# Altium project vision-pi.PrjPcb
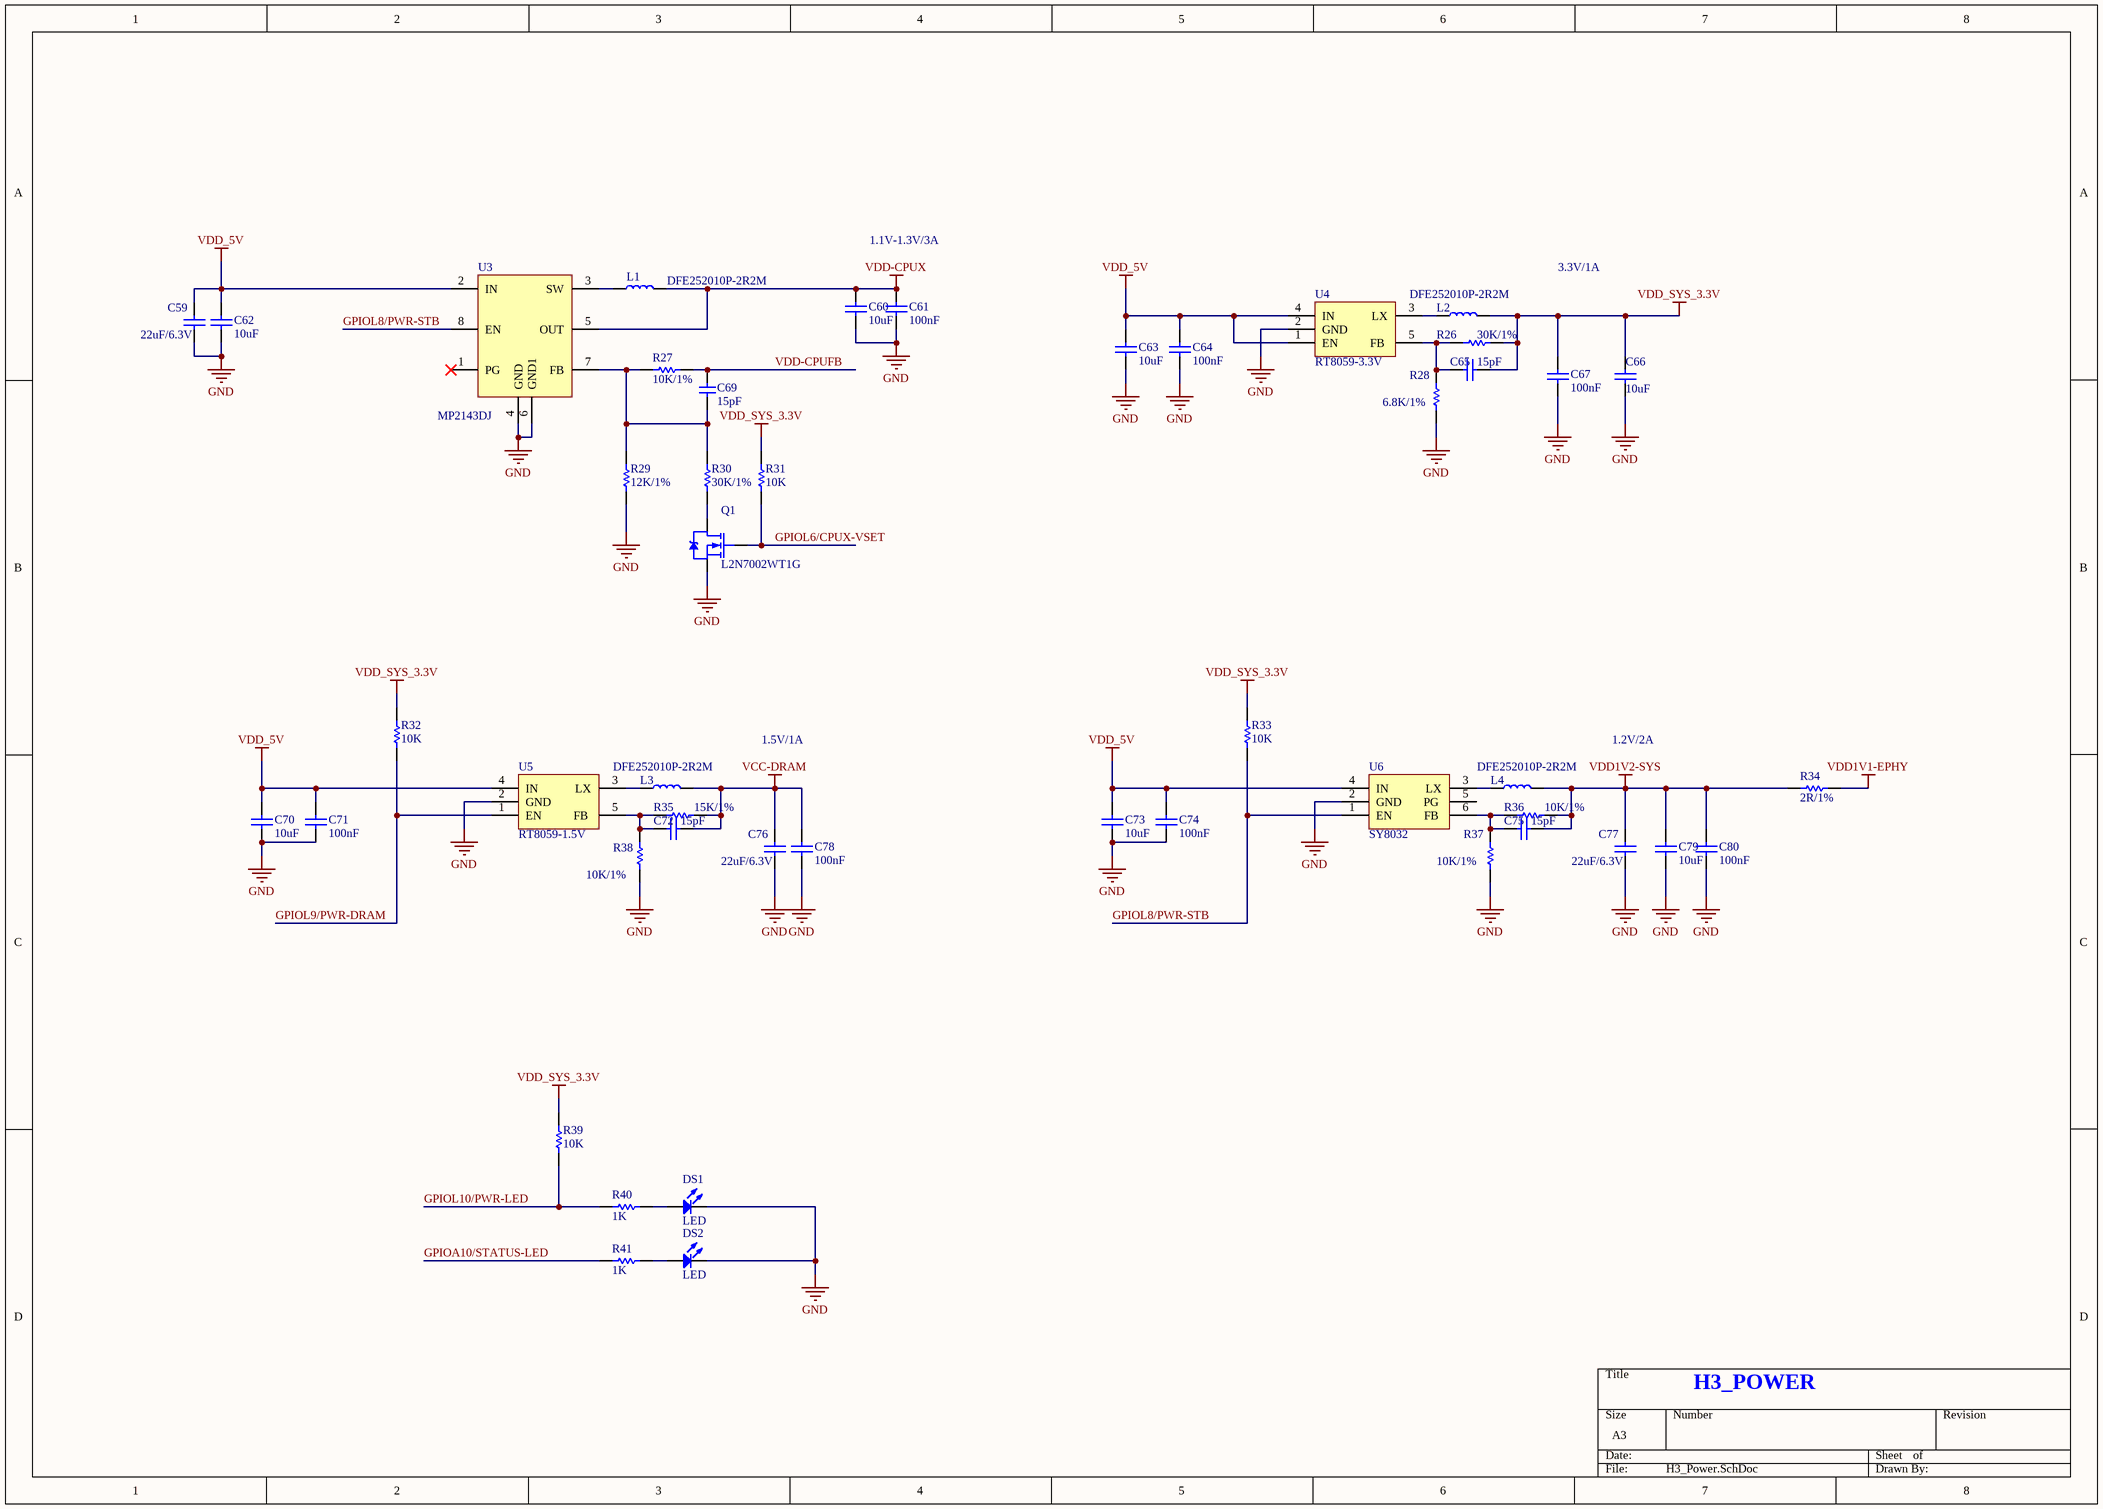
[diagram p0: H3_Power.SchDoc]
8 sheets, 145 parts. Net scope: global (net labels, ports and power ports of the same name join across sheets).
Board file: vision-pi-main.PcbDoc
Sheets:
  H3_Power.SchDoc
  H3_CPU_01.SchDoc
  H3_CPU_02.SchDoc
  H3_Camare.SchDoc
  H3_DDR3.SchDoc
  H3_USB.SchDoc
  H3_eMMC.SchDoc
  H3_SDCard.SchDoc

## Sheet H3_Power.SchDoc
size A3

### Parts
C59  22uF/6.3V  [C0603]
C60  10uF  [C0603]
C61  100nF  [C0402]
C62  10uF  [C0603]
C63  10uF  [C0603]
C64  100nF  [C0402]
C65  15pF  [C0402]
C66  10uF  [C0603]
C67  100nF  [C0402]
C69  15pF  [C0402]
C70  10uF  [C0603]
C71  100nF  [C0402]
C72  15pF  [C0402]
C73  10uF  [C0603]
C74  100nF  [C0402]
C75  15pF  [C0402]
C76  22uF/6.3V  [C0603]
C77  22uF/6.3V  [C0603]
C78  100nF  [C0402]
C79  10uF  [C0603]
C80  100nF  [C0402]
DS1  LED  [LED0603]
DS2  LED  [LED0603]
L1  DFE252010P-2R2M  [L2520]
L2  DFE252010P-2R2M  [L2520]
L3  DFE252010P-2R2M  [L2520]
L4  DFE252010P-2R2M  [L2520]
Q1  L2N7002WT1G  [SOT-23-3L]
R26  30K/1%  [R0402]
R27  10K/1%  [R0402]
R28  6.8K/1%  [R0402]
R29  12K/1%  [R0402]
R30  30K/1%  [R0402]
R31  10K  [R0402]
R32  10K  [R0402]
R33  10K  [R0402]
R34  2R/1%  [R0402]
R35  15K/1%  [R0402]
R36  10K/1%  [R0402]
R37  10K/1%  [R0402]
R38  10K/1%  [R0402]
R39  10K  [R0402]
R40  1K  [R0402]
R41  1K  [R0402]
U3  MP2143DJ  [TSOT23-8]
U4  RT8059-3.3V  [SOT-23-5]
U5  RT8059-1.5V  [SOT-23-5]
U6  SY8032  [SOT23-6]

### Nets
GND: C59.1 C60.1 C61.2 C62.1 C63.1 C64.1 C66.1 C67.2 C70.1 C71.2 C73.1 C74.2 C76.1 C77.1 C78.2 C79.1 C80.2 DS1.2(K) DS2.2(K) Q1.3(S) R28.1 R29.1 R37.1 R38.1 U3.4(GND) U3.6(GND1) U4.2(GND) U5.2(GND) U6.2(GND)
VCC-DRAM: C72.2 C76.2 C78.1 L3.1 R35.1
VDD1V1-EPHY: R34.1
VDD1V2-SYS: C75.2 C77.2 C79.2 C80.1 L4.1 R34.2 R36.1
VDD-CPUX: C60.2 C61.1 L1.1 U3.5(OUT)
VDD_5V: C59.2 C62.2 C63.2 C64.2 C70.2 C71.1 C73.2 C74.1 U3.2(IN) U4.1(EN) U4.4(IN) U5.4(IN) U6.4(IN)
VDD_SYS_3.3V: C65.1 C66.2 C67.1 L2.1 R26.1 R31.2 R32.2 R33.2 R39.2
GPIOA10/STATUS-LED: R41.2
GPIOL6/CPUX-VSET: Q1.1(G) R31.1
GPIOL8/PWR-STB: R33.1 U3.8(EN) U6.1(EN)
GPIOL9/PWR-DRAM: R32.1 U5.1(EN)
GPIOL10/PWR-LED: R39.1 R40.2
VDD-CPUFB: C69.2 R27.1
NetC65_2: C65.2 R26.2 R28.2 U4.5(FB)
NetC69_1: C69.1 R27.2 R29.2 R30.2 U3.7(FB)
NetC72_1: C72.1 R35.2 R38.2 U5.5(FB)
NetC75_1: C75.1 R36.2 R37.2 U6.6(FB)
NetDS1_1: DS1.1(A) R40.1
NetDS2_1: DS2.1(A) R41.1
NetL1_2: L1.2 U3.3(SW)
NetL2_2: L2.2 U4.3(LX)
NetL3_2: L3.2 U5.3(LX)
NetL4_2: L4.2 U6.3(LX)
NetQ1_2: Q1.2(D) R30.1

Not connected (* = marked no-connect by the designer): U3 1(PG)*; U6 5(PG)

### Notes on the sheet
- 1.1V-1.3V/3A
- 3.3V/1A
- 1.5V/1A
- 1.2V/2A
- H3_POWER

### Library data of the parts
C59 C60 C62 C63 C66 C70 C73 C76 C77 C79 = C0603: 电容; Published: 8-Jun-2000; LatestRevisionDate: 17-Jul-2002; LatestRevisionNote: Re-released for DXP Platform.; PackageReference: RAD-0.3; Publisher: Altium Limited; PackageDescription: Radial Cap, Thru-Hole; 2 Leads; 0.3 in Pin Spacing; UnitPrice: 0.02
C61 C64 C65 C67 C71 C72 C74 C75 C78 C80 = C0402: 电容; Published: 8-Jun-2000; LatestRevisionDate: 17-Jul-2002; LatestRevisionNote: Re-released for DXP Platform.; PackageReference: RAD-0.3; Publisher: Altium Limited; PackageDescription: Radial Cap, Thru-Hole; 2 Leads; 0.3 in Pin Spacing; UnitPrice: 0.02
C69 = C: 电容; Published: 8-Jun-2000; LatestRevisionDate: 17-Jul-2002; LatestRevisionNote: Re-released for DXP Platform.; PackageReference: RAD-0.3; Publisher: Altium Limited; PackageDescription: Radial Cap, Thru-Hole; 2 Leads; 0.3 in Pin Spacing; UnitPrice: 0.02
DS1 DS2 = LED: Typical RED, GREEN, YELLOW, AMBER GaAs LED; Published: 8-Jun-2000; LatestRevisionDate: 17-Jul-2002; LatestRevisionNote: Re-released for DXP Platform.; PackageDocument: Feb-2002; PackageReference: 3.2X1.6X1.1; Publisher: Altium Limited; UnitPrice: 0.05
L1-L4 = L: 电感
Q1 = NMOS-2: N-Channel Power MOSFET; Note: Pin 2 is electrically connected to pin 4.; Published: 8-Jun-2000; LatestRevisionDate: 17-Jul-2002; LatestRevisionNote: Re-released for DXP Platform.; DatasheetVersion: PD-9.814; PackageVersion: Feb-1997; PackageReference: TO-220AB; Publisher: Altium Limited; PackageDescription: TO, Thru-Hole, Vertical, Heatsink Mounted; 3 In-Line Leads; Pitch 2.54 mm; ComponentLink1Description: Manufacturer Link; ComponentLink1URL: http://www.irf.com/
R26-R41 = RES0402: 电阻; Published: 8-Jun-2000; LatestRevisionDate: 17-Jul-2002; LatestRevisionNote: Re-released for DXP Platform.; PackageReference: AXIAL-0.3; Publisher: Altium Limited; PackageDescription: Axial Device, Thru-Hole; 2 Leads; 0.3 in Pin Spacing
U4 U5 = RT8059

## Sheet H3_CPU_01.SchDoc
size A3
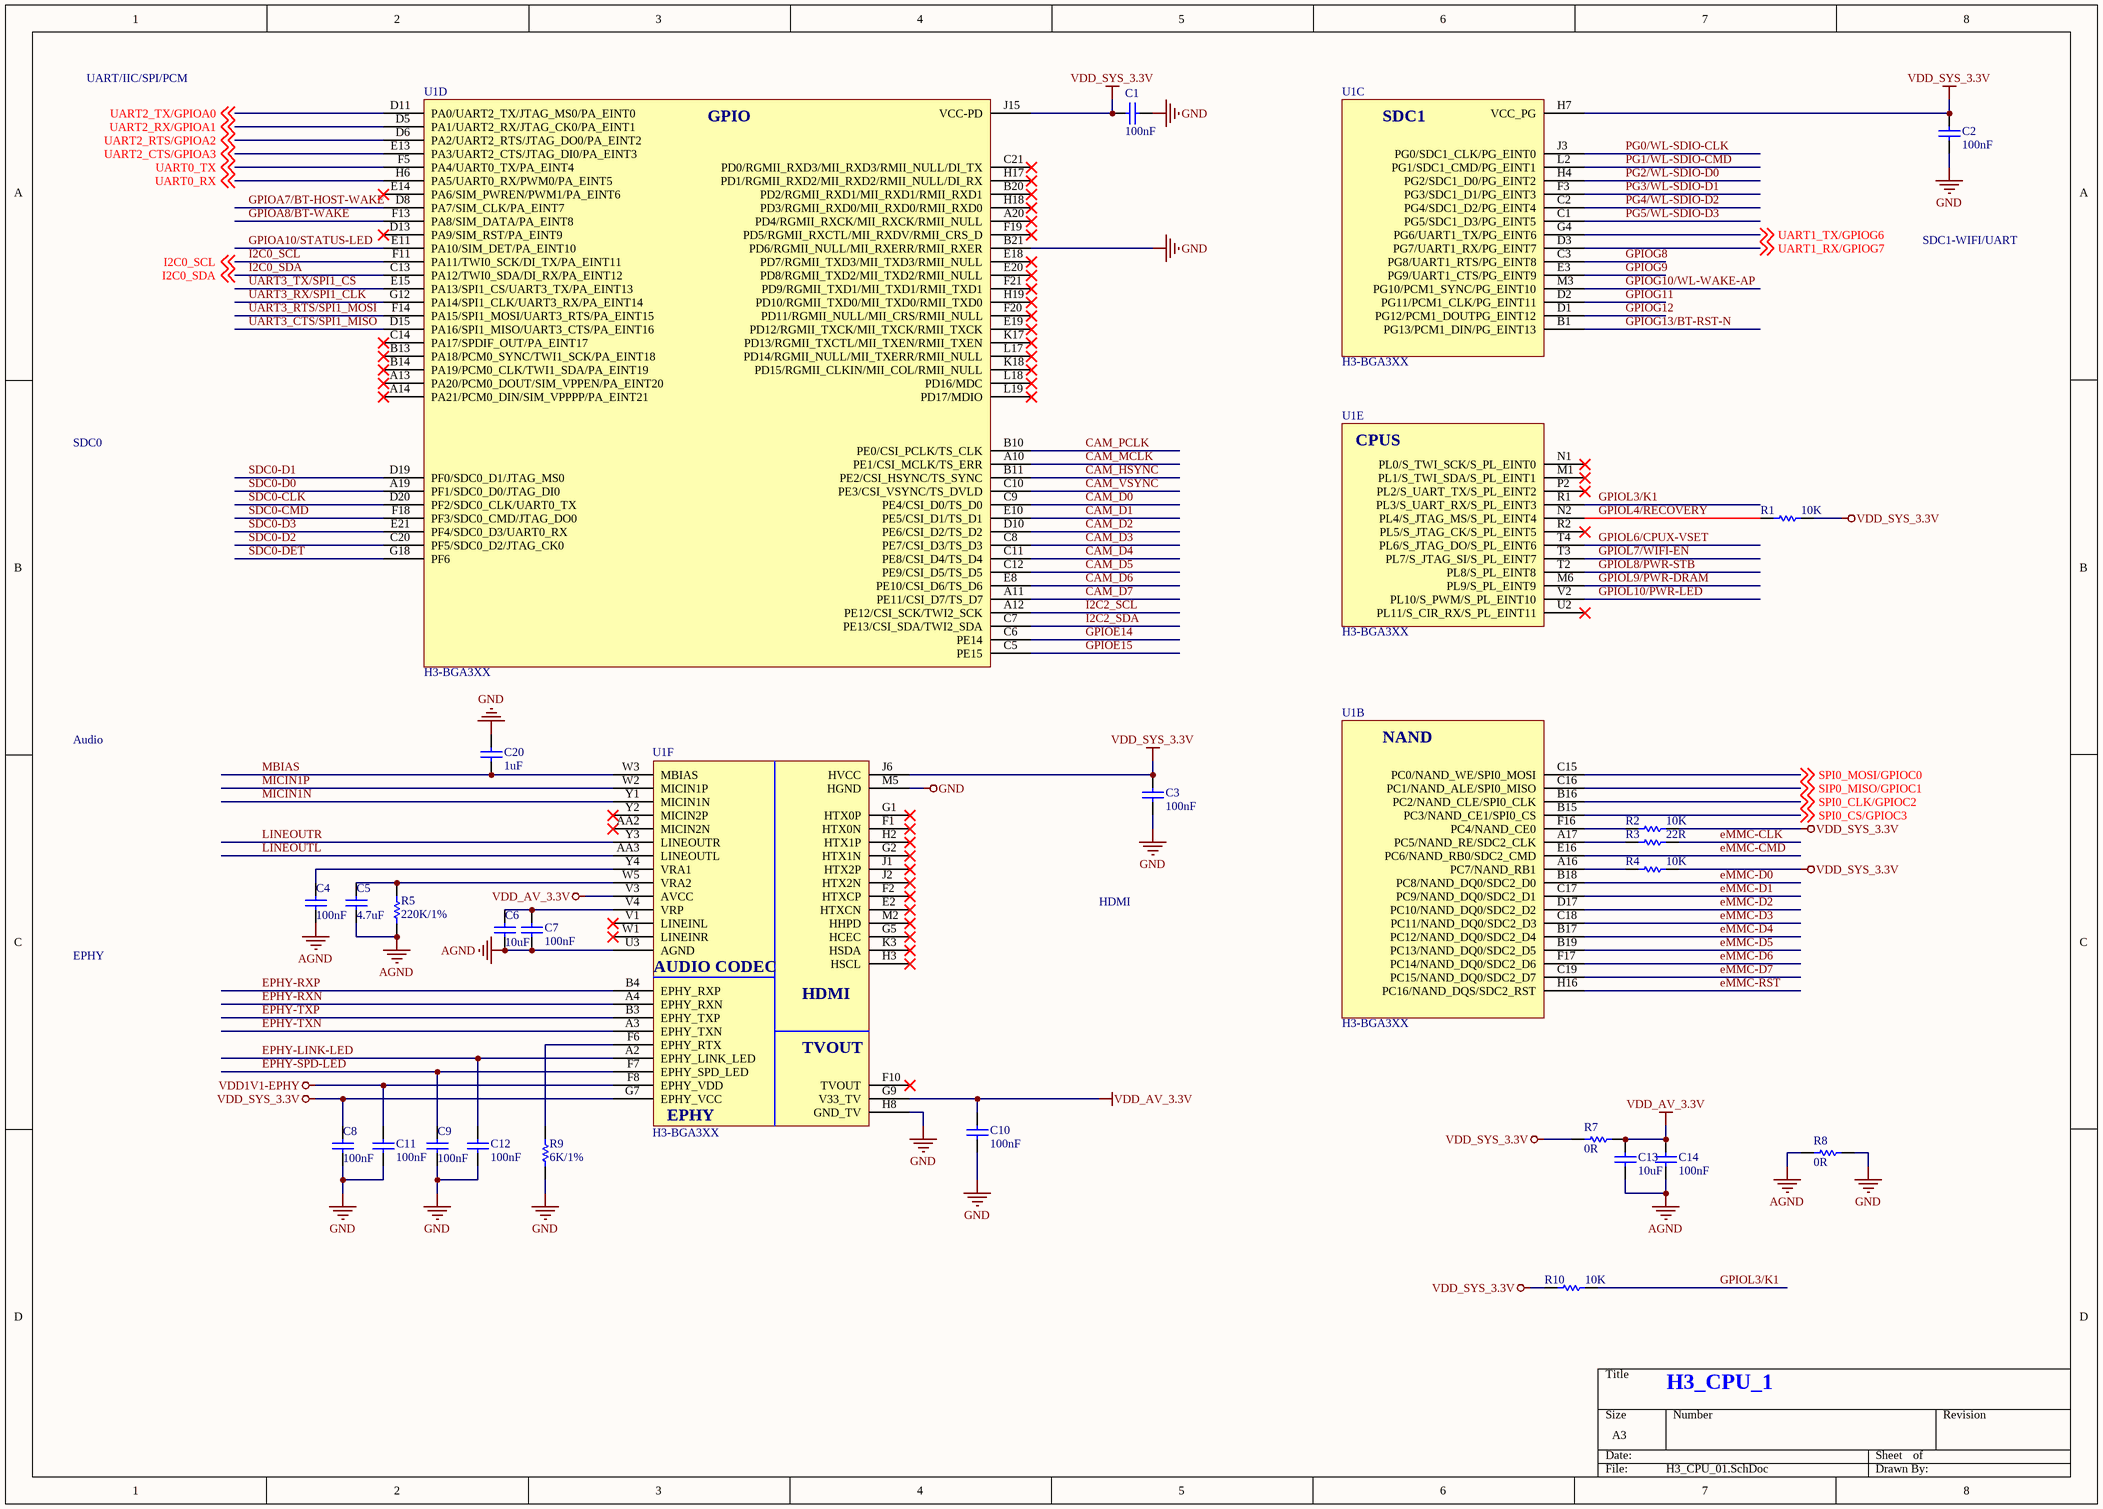
[diagram p1: H3_CPU_01.SchDoc]

### Parts
C1  100nF  [C0402]
C2  100nF  [C0402]
C3  100nF  [C0402]
C4  100nF  [C0402]
C5  4.7uF  [C0402]
C6  10uF  [C0603]
C7  100nF  [C0402]
C8  100nF  [C0402]
C9  100nF  [C0402]
C10  100nF  [C0402]
C11  100nF  [C0402]
C12  100nF  [C0402]
C13  10uF  [C0603]
C14  100nF  [C0402]
C20  1uF  [C0402]
R1  10K  [R0402]
R2  10K  [R0402]
R3  22R  [R0402]
R4  10K  [R0402]
R5  220K/1%  [R0402]
R7  0R  [R0402]
R8  0R  [R0402]
R9  6K/1%  [R0402]
R10  10K  [R0402]
U1  H3-BGA3XX  [BGA-H3-347]  (parts B,C,D,E,F of 9)

### Nets
AGND: C4.1 C5.1 C6.1 C7.1 C13.1 C14.1 R5.1 R8.1 U1.U3(AGND)
GND: C1.1 C2.1 C3.1 C8.1 C9.1 C10.1 C11.1 C12.1 C20.2 R8.2 R9.1 U1.B21(PD6/RGMII_NULL/MII_RXERR/RMII_RXER) U1.H8(GND_TV) U1.M5(HGND)
VDD1V1-EPHY: C11.2 U1.F8(EPHY_VDD)
VDD_AV_3.3V: C10.2 C13.2 C14.2 R7.2 U1.G9(V33_TV) U1.V3(AVCC)
VDD_SYS_3.3V: C1.2 C2.2 C3.2 C8.2 R1.1 R2.1 R4.1 R7.1 R10.2 U1.G7(EPHY_VCC) U1.H7(VCC_PG) U1.J6(HVCC) U1.J15(VCC-PD)
CAM_D0: U1.C9(PE4/CSI_D0/TS_D0)
CAM_D1: U1.E10(PE5/CSI_D1/TS_D1)
CAM_D2: U1.D10(PE6/CSI_D2/TS_D2)
CAM_D3: U1.C8(PE7/CSI_D3/TS_D3)
CAM_D4: U1.C11(PE8/CSI_D4/TS_D4)
CAM_D5: U1.C12(PE9/CSI_D5/TS_D5)
CAM_D6: U1.E8(PE10/CSI_D6/TS_D6)
CAM_D7: U1.A11(PE11/CSI_D7/TS_D7)
CAM_HSYNC: U1.B11(PE2/CSI_HSYNC/TS_SYNC)
CAM_MCLK: U1.A10(PE1/CSI_MCLK/TS_ERR)
CAM_PCLK: U1.B10(PE0/CSI_PCLK/TS_CLK)
CAM_VSYNC: U1.C10(PE3/CSI_VSYNC/TS_DVLD)
eMMC-CLK: R3.1
eMMC-CMD: U1.E16(PC6/NAND_RB0/SDC2_CMD)
eMMC-D0: U1.B18(PC8/NAND_DQ0/SDC2_D0)
eMMC-D1: U1.C17(PC9/NAND_DQ0/SDC2_D1)
eMMC-D2: U1.D17(PC10/NAND_DQ0/SDC2_D2)
eMMC-D3: U1.C18(PC11/NAND_DQ0/SDC2_D3)
eMMC-D4: U1.B17(PC12/NAND_DQ0/SDC2_D4)
eMMC-D5: U1.B19(PC13/NAND_DQ0/SDC2_D5)
eMMC-D6: U1.F17(PC14/NAND_DQ0/SDC2_D6)
eMMC-D7: U1.C19(PC15/NAND_DQ0/SDC2_D7)
eMMC-RST: U1.H16(PC16/NAND_DQS/SDC2_RST)
EPHY-LINK-LED: C12.2 U1.A2(EPHY_LINK_LED)
EPHY-RXN: U1.A4(EPHY_RXN)
EPHY-RXP: U1.B4(EPHY_RXP)
EPHY-SPD-LED: C9.2 U1.F7(EPHY_SPD_LED)
EPHY-TXN: U1.A3(EPHY_TXN)
EPHY-TXP: U1.B3(EPHY_TXP)
GPIOA7/BT-HOST-WAKE: U1.D8(PA7/SIM_CLK/PA_EINT7)
GPIOA8/BT-WAKE: U1.F13(PA8/SIM_DATA/PA_EINT8)
GPIOA10/STATUS-LED: U1.E11(PA10/SIM_DET/PA_EINT10)
GPIOE14: U1.C6(PE14)
GPIOE15: U1.C5(PE15)
GPIOG8: U1.C3(PG8/UART1_RTS/PG_EINT8)
GPIOG9: U1.E3(PG9/UART1_CTS/PG_EINT9)
GPIOG10/WL-WAKE-AP: U1.M3(PG10/PCM1_SYNC/PG_EINT10)
GPIOG11: U1.D2(PG11/PCM1_CLK/PG_EINT11)
GPIOG12: U1.D1(PG12/PCM1_DOUTPG_EINT12)
GPIOG13/BT-RST-N: U1.B1(PG13/PCM1_DIN/PG_EINT13)
GPIOL3/K1: R10.1 U1.R1(PL3/S_UART_RX/S_PL_EINT3)
GPIOL4/RECOVERY: R1.2 U1.N2(PL4/S_JTAG_MS/S_PL_EINT4)
GPIOL6/CPUX-VSET: U1.T4(PL6/S_JTAG_DO/S_PL_EINT6)
GPIOL7/WIFI-EN: U1.T3(PL7/S_JTAG_SI/S_PL_EINT7)
GPIOL8/PWR-STB: U1.T2(PL8/S_PL_EINT8)
GPIOL9/PWR-DRAM: U1.M6(PL9/S_PL_EINT9)
GPIOL10/PWR-LED: U1.V2(PL10/S_PWM/S_PL_EINT10)
I2C0_SCL: U1.F11(PA11/TWI0_SCK/DI_TX/PA_EINT11) ; off-sheet I2C0_SCL
I2C0_SDA: U1.C13(PA12/TWI0_SDA/DI_RX/PA_EINT12) ; off-sheet I2C0_SDA
I2C2_SCL: U1.A12(PE12/CSI_SCK/TWI2_SCK)
I2C2_SDA: U1.C7(PE13/CSI_SDA/TWI2_SDA)
LINEOUTL: U1.AA3(LINEOUTL)
LINEOUTR: U1.Y3(LINEOUTR)
MBIAS: C20.1 U1.W3(MBIAS)
MICIN1N: U1.Y1(MICIN1N)
MICIN1P: U1.W2(MICIN1P)
PG0/WL-SDIO-CLK: U1.J3(PG0/SDC1_CLK/PG_EINT0)
PG1/WL-SDIO-CMD: U1.L2(PG1/SDC1_CMD/PG_EINT1)
PG2/WL-SDIO-D0: U1.H4(PG2/SDC1_D0/PG_EINT2)
PG3/WL-SDIO-D1: U1.F3(PG3/SDC1_D1/PG_EINT3)
PG4/WL-SDIO-D2: U1.C2(PG4/SDC1_D2/PG_EINT4)
PG5/WL-SDIO-D3: U1.C1(PG5/SDC1_D3/PG_EINT5)
SDC0-CLK: U1.D20(PF2/SDC0_CLK/UART0_TX)
SDC0-CMD: U1.F18(PF3/SDC0_CMD/JTAG_DO0)
SDC0-D0: U1.A19(PF1/SDC0_D0/JTAG_DI0)
SDC0-D1: U1.D19(PF0/SDC0_D1/JTAG_MS0)
SDC0-D2: U1.C20(PF5/SDC0_D2/JTAG_CK0)
SDC0-D3: U1.E21(PF4/SDC0_D3/UART0_RX)
SDC0-DET: U1.G18(PF6)
SIP0_MISO/GPIOC1: U1.C16(PC1/NAND_ALE/SPI0_MISO) ; off-sheet SIP0_MISO/GPIOC1
SPI0_CLK/GPIOC2: U1.B16(PC2/NAND_CLE/SPI0_CLK) ; off-sheet SPI0_CLK/GPIOC2
SPI0_CS/GPIOC3: U1.B15(PC3/NAND_CE1/SPI0_CS) ; off-sheet SPI0_CS/GPIOC3
SPI0_MOSI/GPIOC0: U1.C15(PC0/NAND_WE/SPI0_MOSI) ; off-sheet SPI0_MOSI/GPIOC0
UART0_RX: U1.H6(PA5/UART0_RX/PWM0/PA_EINT5) ; off-sheet UART0_RX
UART0_TX: U1.F5(PA4/UART0_TX/PA_EINT4) ; off-sheet UART0_TX
UART1_RX/GPIOG7: U1.D3(PG7/UART1_RX/PG_EINT7) ; off-sheet UART1_RX/GPIOG7
UART1_TX/GPIOG6: U1.G4(PG6/UART1_TX/PG_EINT6) ; off-sheet UART1_TX/GPIOG6
UART2_CTS/GPIOA3: U1.E13(PA3/UART2_CTS/JTAG_DI0/PA_EINT3) ; off-sheet UART2_CTS/GPIOA3
UART2_RTS/GPIOA2: U1.D6(PA2/UART2_RTS/JTAG_DO0/PA_EINT2) ; off-sheet UART2_RTS/GPIOA2
UART2_RX/GPIOA1: U1.D5(PA1/UART2_RX/JTAG_CK0/PA_EINT1) ; off-sheet UART2_RX/GPIOA1
UART2_TX/GPIOA0: U1.D11(PA0/UART2_TX/JTAG_MS0/PA_EINT0) ; off-sheet UART2_TX/GPIOA0
UART3_CTS/SPI1_MISO: U1.D15(PA16/SPI1_MISO/UART3_CTS/PA_EINT16)
UART3_RTS/SPI1_MOSI: U1.F14(PA15/SPI1_MOSI/UART3_RTS/PA_EINT15)
UART3_RX/SPI1_CLK: U1.G12(PA14/SPI1_CLK/UART3_RX/PA_EINT14)
UART3_TX/SPI1_CS: U1.E15(PA13/SPI1_CS/UART3_TX/PA_EINT13)
NetC4_2: C4.2 U1.Y4(VRA1)
NetC5_2: C5.2 R5.2 U1.W5(VRA2)
NetC6_2: C6.2 C7.2 U1.V4(VRP)
NetR2_2: R2.2 U1.F16(PC4/NAND_CE0)
NetR3_2: R3.2 U1.A17(PC5/NAND_RE/SDC2_CLK)
NetR4_2: R4.2 U1.A16(PC7/NAND_RB1)
NetR9_2: R9.2 U1.F6(EPHY_RTX)

Not connected (* = marked no-connect by the designer): U1 A13(PA20/PCM0_DOUT/SIM_VPPEN/PA_EINT20)* A14(PA21/PCM0_DIN/SIM_VPPPP/PA_EINT21)* A20(PD4/RGMII_RXCK/MII_RXCK/RMII_NULL)* AA2(MICIN2N)* B13(PA18/PCM0_SYNC/TWI1_SCK/PA_EINT18)* B14(PA19/PCM0_CLK/TWI1_SDA/PA_EINT19)* B20(PD2/RGMII_RXD1/MII_RXD1/RMII_RXD1)* C14(PA17/SPDIF_OUT/PA_EINT17)* C21(PD0/RGMII_RXD3/MII_RXD3/RMII_NULL/DI_TX)* D13(PA9/SIM_RST/PA_EINT9)* E2(HTXCN)* E14(PA6/SIM_PWREN/PWM1/PA_EINT6)* E18(PD7/RGMII_TXD3/MII_TXD3/RMII_NULL)* E19(PD12/RGMII_TXCK/MII_TXCK/RMII_TXCK)* E20(PD8/RGMII_TXD2/MII_TXD2/RMII_NULL)* F1(HTX0N)* F2(HTXCP)* F10(TVOUT)* F19(PD5/RGMII_RXCTL/MII_RXDV/RMII_CRS_D)* F20(PD11/RGMII_NULL/MII_CRS/RMII_NULL)* F21(PD9/RGMII_TXD1/MII_TXD1/RMII_TXD1)* G1(HTX0P)* G2(HTX1N)* G5(HCEC)* H2(HTX1P)* H3(HSCL)* H17(PD1/RGMII_RXD2/MII_RXD2/RMII_NULL/DI_RX)* H18(PD3/RGMII_RXD0/MII_RXD0/RMII_RXD0)* H19(PD10/RGMII_TXD0/MII_TXD0/RMII_TXD0)* J1(HTX2P)* J2(HTX2N)* K3(HSDA)* K17(PD13/RGMII_TXCTL/MII_TXEN/RMII_TXEN)* K18(PD15/RGMII_CLKIN/MII_COL/RMII_NULL)* L17(PD14/RGMII_NULL/MII_TXERR/RMII_NULL)* L18(PD16/MDC)* L19(PD17/MDIO)* M1(PL1/S_TWI_SDA/S_PL_EINT1)* M2(HHPD)* N1(PL0/S_TWI_SCK/S_PL_EINT0)* P2(PL2/S_UART_TX/S_PL_EINT2)* R2(PL5/S_JTAG_CK/S_PL_EINT5)* U2(PL11/S_CIR_RX/S_PL_EINT11)* V1(LINEINL)* W1(LINEINR)* Y2(MICIN2P)*

### Notes on the sheet
- UART/IIC/SPI/PCM
- SDC1-WIFI/UART
- SDC0
- Audio
- HDMI
- EPHY
- H3_CPU_1
- (in symbol H3-BGA3XX, part B) NAND
- (in symbol H3-BGA3XX, part C) SDC1
- (in symbol H3-BGA3XX, part D) GPIO
- (in symbol H3-BGA3XX, part E) CPUS
- (in symbol H3-BGA3XX, part F) AUDIO CODEC; HDMI; EPHY

### Library data of the parts
C1-C5 C7-C12 C14 C20 = C0402: 电容; Published: 8-Jun-2000; LatestRevisionDate: 17-Jul-2002; LatestRevisionNote: Re-released for DXP Platform.; PackageReference: RAD-0.3; Publisher: Altium Limited; PackageDescription: Radial Cap, Thru-Hole; 2 Leads; 0.3 in Pin Spacing; UnitPrice: 0.02
C6 C13 = C0603: 电容; Published: 8-Jun-2000; LatestRevisionDate: 17-Jul-2002; LatestRevisionNote: Re-released for DXP Platform.; PackageReference: RAD-0.3; Publisher: Altium Limited; PackageDescription: Radial Cap, Thru-Hole; 2 Leads; 0.3 in Pin Spacing; UnitPrice: 0.02
R1-R5 R7-R10 = RES0402: 电阻; Published: 8-Jun-2000; LatestRevisionDate: 17-Jul-2002; LatestRevisionNote: Re-released for DXP Platform.; PackageReference: AXIAL-0.3; Publisher: Altium Limited; PackageDescription: Axial Device, Thru-Hole; 2 Leads; 0.3 in Pin Spacing

## Sheet H3_CPU_02.SchDoc
size A3
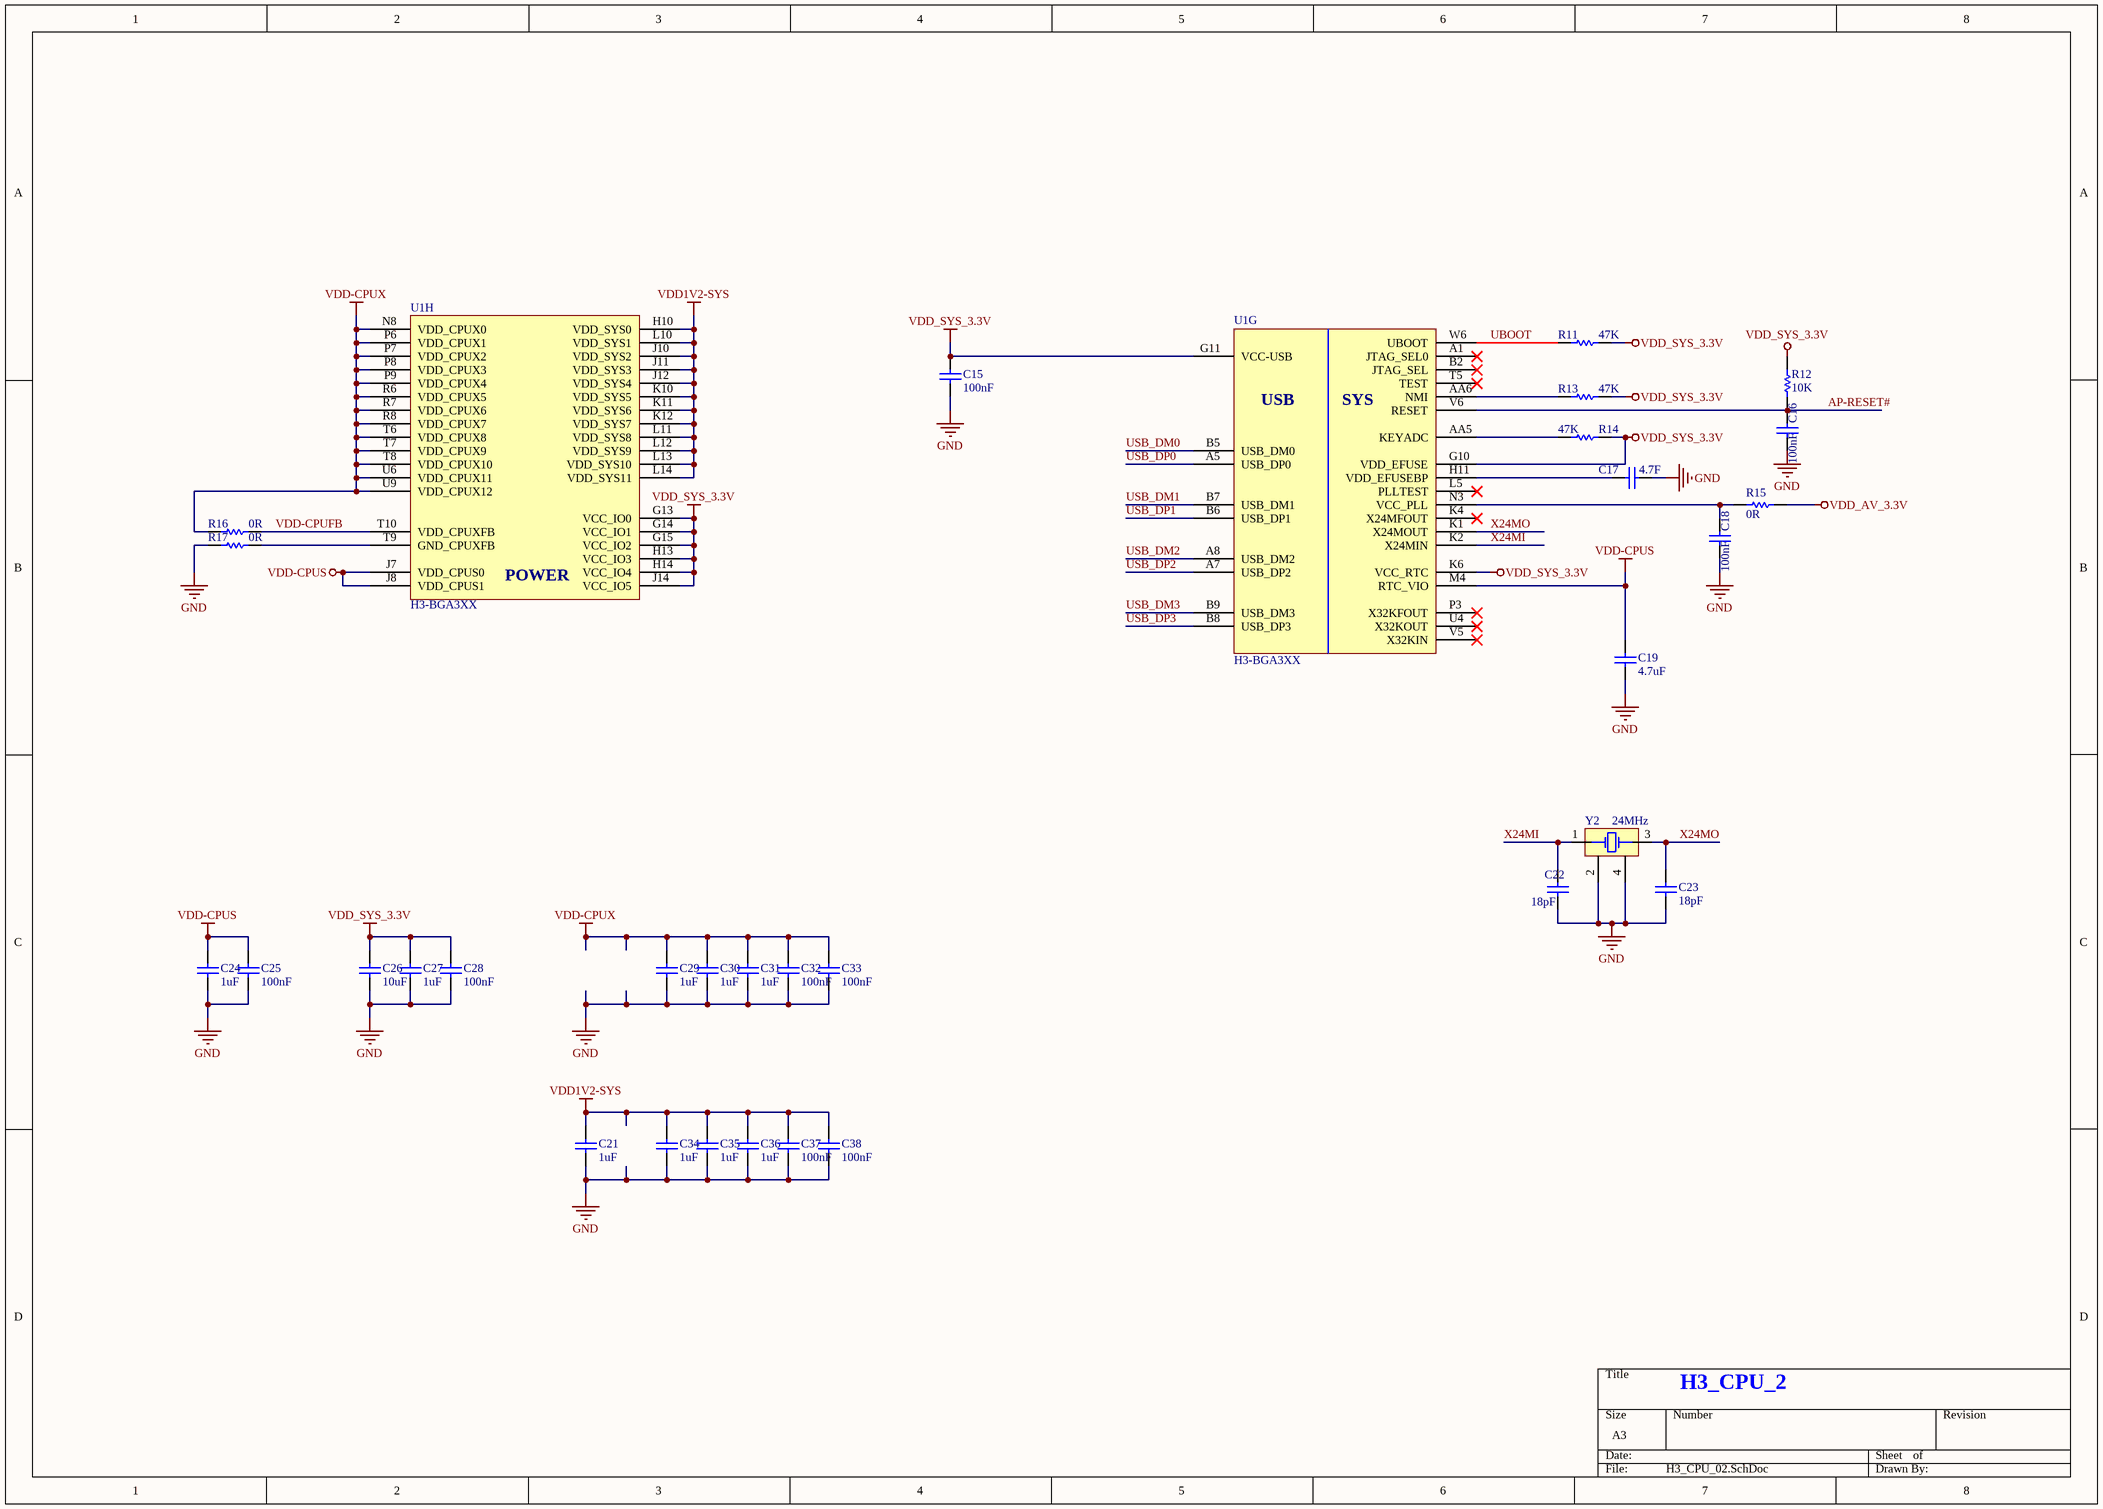
[diagram p2: H3_CPU_02.SchDoc]

### Parts
C15  100nF  [C0402]
C16  100nF  [C0402]
C17  4.7F  [C0402]
C18  100nF  [C0402]
C19  4.7uF  [C0402]
C21  1uF  [C0402]
C22  18pF  [C0402]
C23  18pF  [C0402]
C24  1uF  [C0402]
C25  100nF  [C0402]
C26  10uF  [C0603]
C27  1uF  [C0402]
C28  100nF  [C0402]
C29  1uF  [C0402]
C30  1uF  [C0402]
C31  1uF  [C0402]
C32  100nF  [C0402]
C33  100nF  [C0402]
C34  1uF  [C0402]
C35  1uF  [C0402]
C36  1uF  [C0402]
C37  100nF  [C0402]
C38  100nF  [C0402]
R11  47K  [R0402]
R12  10K  [R0402]
R13  47K  [R0402]
R14  47K  [R0402]
R15  0R  [R0402]
R16  0R  [R0402]
R17  0R  [R0402]
U1  H3-BGA3XX  [BGA-H3-347]  (parts G,H of 9)
Y2  24MHz  [X-TSX-3225]

### Nets
GND: C15.1 C16.1 C17.1 C18.1 C19.1 C21.1 C22.1 C23.1 C24.1 C25.1 C26.1 C27.1 C28.1 C29.1 C30.1 C31.1 C32.1 C33.1 C34.1 C35.1 C36.1 C37.1 C38.1 R17.1 Y2.2 Y2.4
VDD1V2-SYS: C21.2 C34.2 C35.2 C36.2 C37.2 C38.2 U1.H10(VDD_SYS0) U1.J10(VDD_SYS2) U1.J11(VDD_SYS3) U1.J12(VDD_SYS4) U1.K10(VDD_SYS5) U1.K11(VDD_SYS6) U1.K12(VDD_SYS7) U1.L10(VDD_SYS1) U1.L11(VDD_SYS8) U1.L12(VDD_SYS9) U1.L13(VDD_SYS10) U1.L14(VDD_SYS11)
VDD-CPUS: C19.2 C24.2 C25.2 U1.J7(VDD_CPUS0) U1.J8(VDD_CPUS1) U1.M4(RTC_VIO)
VDD-CPUX: C29.2 C30.2 C31.2 C32.2 C33.2 R16.2 U1.N8(VDD_CPUX0) U1.P6(VDD_CPUX1) U1.P7(VDD_CPUX2) U1.P8(VDD_CPUX3) U1.P9(VDD_CPUX4) U1.R6(VDD_CPUX5) U1.R7(VDD_CPUX6) U1.R8(VDD_CPUX7) U1.T6(VDD_CPUX8) U1.T7(VDD_CPUX9) U1.T8(VDD_CPUX10) U1.U6(VDD_CPUX11) U1.U9(VDD_CPUX12)
VDD_AV_3.3V: R15.1
VDD_SYS_3.3V: C15.2 C26.2 C27.2 C28.2 R11.1 R12.2 R13.2 R14.2 U1.G10(VDD_EFUSE) U1.G11(VCC-USB) U1.G13(VCC_IO0) U1.G14(VCC_IO1) U1.G15(VCC_IO2) U1.H13(VCC_IO3) U1.H14(VCC_IO4) U1.J14(VCC_IO5) U1.K6(VCC_RTC)
AP-RESET#: C16.2 R12.1 U1.V6(RESET)
UBOOT: R11.2 U1.W6(UBOOT)
USB_DM0: U1.B5(USB_DM0)
USB_DM1: U1.B7(USB_DM1)
USB_DM2: U1.A8(USB_DM2)
USB_DM3: U1.B9(USB_DM3)
USB_DP0: U1.A5(USB_DP0)
USB_DP1: U1.B6(USB_DP1)
USB_DP2: U1.A7(USB_DP2)
USB_DP3: U1.B8(USB_DP3)
VDD-CPUFB: R16.1 U1.T10(VDD_CPUXFB)
X24MI: C22.2 U1.K2(X24MIN) Y2.1
X24MO: C23.2 U1.K1(X24MOUT) Y2.3
NetC17_2: C17.2 U1.H11(VDD_EFUSEBP)
NetC18_2: C18.2 R15.2 U1.N3(VCC_PLL)
NetR13_1: R13.1 U1.AA6(NMI)
NetR14_1: R14.1 U1.AA5(KEYADC)
NetR17_2: R17.2 U1.T9(GND_CPUXFB)

Not connected (* = marked no-connect by the designer): U1 A1(JTAG_SEL0)* B2(JTAG_SEL)* K4(X24MFOUT)* L5(PLLTEST)* P3(X32KFOUT)* T5(TEST)* U4(X32KOUT)* V5(X32KIN)*

### Notes on the sheet
- H3_CPU_2
- (in symbol H3-BGA3XX, part G) USB; SYS
- (in symbol H3-BGA3XX, part H) POWER

### Library data of the parts
C15-C19 C21-C25 C27-C38 = C0402: 电容; Published: 8-Jun-2000; LatestRevisionDate: 17-Jul-2002; LatestRevisionNote: Re-released for DXP Platform.; PackageReference: RAD-0.3; Publisher: Altium Limited; PackageDescription: Radial Cap, Thru-Hole; 2 Leads; 0.3 in Pin Spacing; UnitPrice: 0.02
C26 = C0603: 电容; Published: 8-Jun-2000; LatestRevisionDate: 17-Jul-2002; LatestRevisionNote: Re-released for DXP Platform.; PackageReference: RAD-0.3; Publisher: Altium Limited; PackageDescription: Radial Cap, Thru-Hole; 2 Leads; 0.3 in Pin Spacing; UnitPrice: 0.02
R11-R17 = RES0402: 电阻; Published: 8-Jun-2000; LatestRevisionDate: 17-Jul-2002; LatestRevisionNote: Re-released for DXP Platform.; PackageReference: AXIAL-0.3; Publisher: Altium Limited; PackageDescription: Axial Device, Thru-Hole; 2 Leads; 0.3 in Pin Spacing
Y2 = XTAL_1: Crystal Oscillator; Published: 8-Jun-2000; LatestRevisionDate: 17-Jul-2002; LatestRevisionNote: Re-released for DXP Platform.; Publisher: Altium Limited

## Sheet H3_Camare.SchDoc
size A4

## Sheet H3_DDR3.SchDoc
size A3
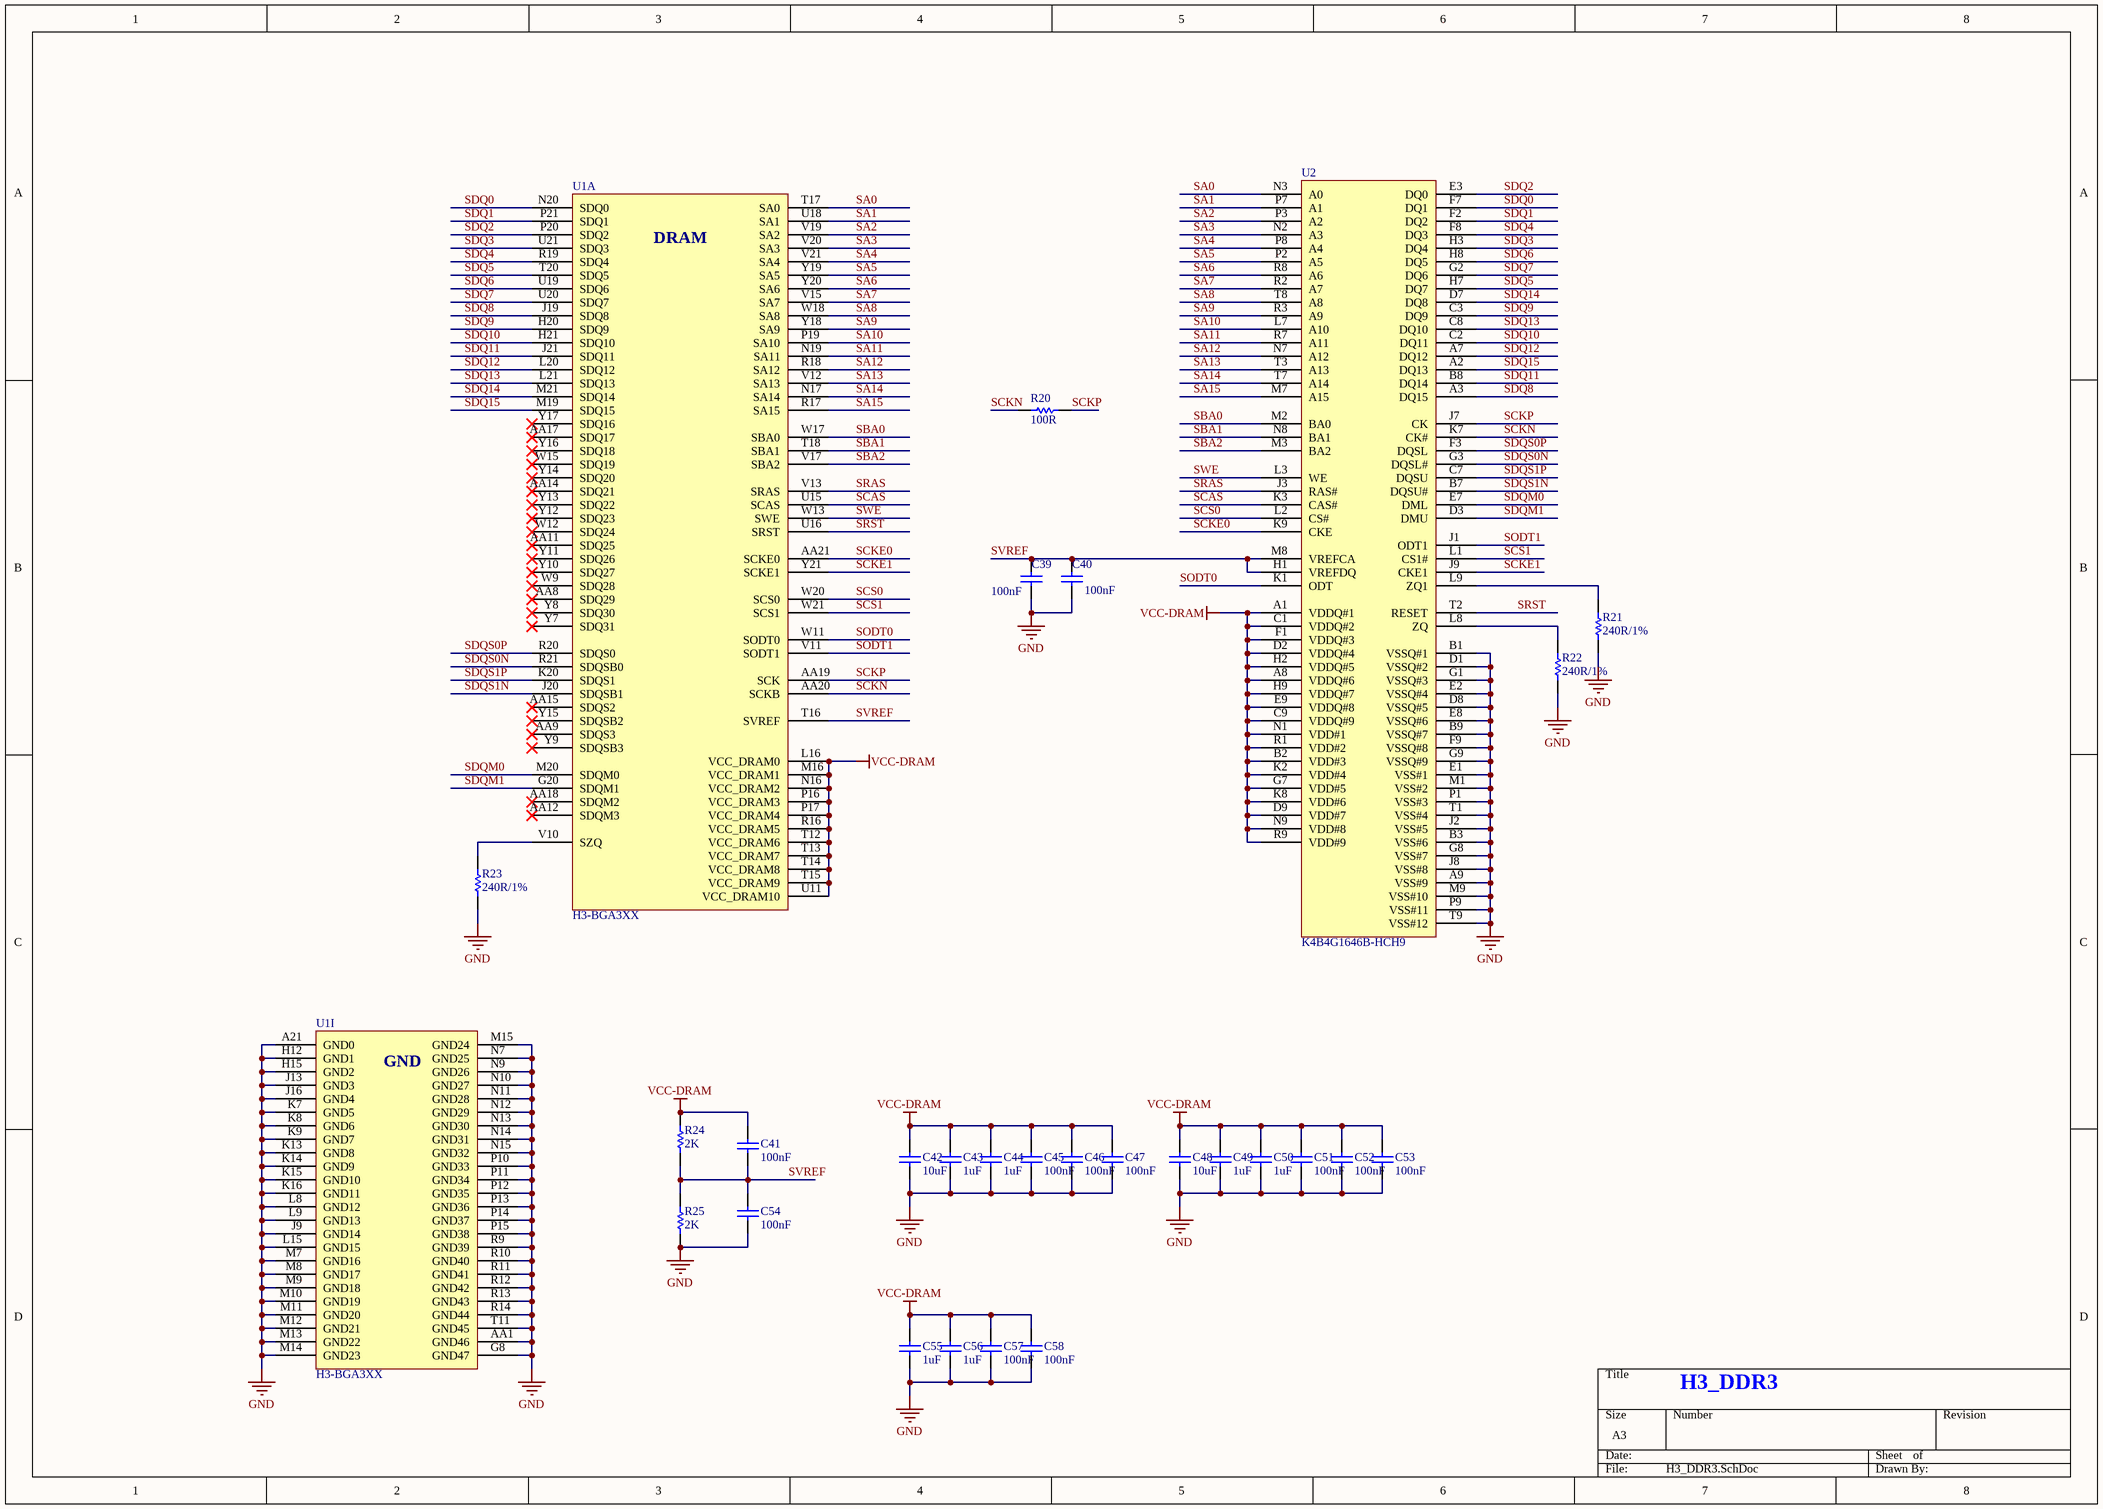
[diagram p3: H3_DDR3.SchDoc]

### Parts
C39  100nF  [C0402]
C40  100nF  [C0402]
C41  100nF  [C0402]
C42  10uF  [C0603]
C43  1uF  [C0402]
C44  1uF  [C0402]
C45  100nF  [C0402]
C46  100nF  [C0402]
C47  100nF  [C0402]
C48  10uF  [C0603]
C49  1uF  [C0402]
C50  1uF  [C0402]
C51  100nF  [C0402]
C52  100nF  [C0402]
C53  100nF  [C0402]
C54  100nF  [C0402]
C55  1uF  [C0402]
C56  1uF  [C0402]
C57  100nF  [C0402]
C58  100nF  [C0402]
R20  100R  [R0402]
R21  240R/1%  [R0402]
R22  240R/1%  [R0402]
R23  240R/1%  [R0402]
R24  2K  [R0402]
R25  2K  [R0402]
U1  H3-BGA3XX  [BGA-H3-347]  (parts A,I of 9)
U2  K4B4G1646B-HCH9  [FBGA-96]

### Nets
GND: C39.1 C40.1 C42.1 C43.1 C44.1 C45.1 C46.1 C47.1 C48.1 C49.1 C50.1 C51.1 C52.1 C53.1 C54.1 C55.1 C56.1 C57.1 C58.1 R21.1 R22.1 R23.1 R25.2 U1.A21(GND0) U1.AA1(GND46) U1.G8(GND47) U1.H12(GND1) U1.H15(GND2) U1.J9(GND14) U1.J13(GND3) U1.J16(GND4) U1.K7(GND5) U1.K8(GND6) U1.K9(GND7) U1.K13(GND8) U1.K14(GND9) U1.K15(GND10) U1.K16(GND11) U1.L8(GND12) U1.L9(GND13) U1.L15(GND15) U1.M7(GND16) U1.M8(GND17) U1.M9(GND18) U1.M10(GND19) U1.M11(GND20) U1.M12(GND21) U1.M13(GND22) U1.M14(GND23) U1.M15(GND24) U1.N7(GND25) U1.N9(GND26) U1.N10(GND27) U1.N11(GND28) U1.N12(GND29) U1.N13(GND30) U1.N14(GND31) U1.N15(GND32) U1.P10(GND33) U1.P11(GND34) U1.P12(GND35) U1.P13(GND36) U1.P14(GND37) U1.P15(GND38) U1.R9(GND39) U1.R10(GND40) U1.R11(GND41) U1.R12(GND42) U1.R13(GND43) U1.R14(GND44) U1.T11(GND45) U2.A9(VSS#9) U2.B1(VSSQ#1) U2.B3(VSS#6) U2.B9(VSSQ#7) U2.D1(VSSQ#2) U2.D8(VSSQ#5) U2.E1(VSS#1) U2.E2(VSSQ#4) U2.E8(VSSQ#6) U2.F9(VSSQ#8) U2.G1(VSSQ#3) U2.G8(VSS#7) U2.G9(VSSQ#9) U2.J2(VSS#5) U2.J8(VSS#8) U2.M1(VSS#2) U2.M9(VSS#10) U2.P1(VSS#3) U2.P9(VSS#11) U2.T1(VSS#4) U2.T9(VSS#12)
VCC-DRAM: C41.2 C42.2 C43.2 C44.2 C45.2 C46.2 C47.2 C48.2 C49.2 C50.2 C51.2 C52.2 C53.2 C55.2 C56.2 C57.2 C58.2 R24.1 U1.L16(VCC_DRAM0) U1.M16(VCC_DRAM1) U1.N16(VCC_DRAM2) U1.P16(VCC_DRAM3) U1.P17(VCC_DRAM4) U1.R16(VCC_DRAM5) U1.T12(VCC_DRAM6) U1.T13(VCC_DRAM7) U1.T14(VCC_DRAM8) U1.T15(VCC_DRAM9) U1.U11(VCC_DRAM10) U2.A1(VDDQ#1) U2.A8(VDDQ#6) U2.B2(VDD#3) U2.C1(VDDQ#2) U2.C9(VDDQ#9) U2.D2(VDDQ#4) U2.D9(VDD#7) U2.E9(VDDQ#8) U2.F1(VDDQ#3) U2.G7(VDD#5) U2.H2(VDDQ#5) U2.H9(VDDQ#7) U2.K2(VDD#4) U2.K8(VDD#6) U2.N1(VDD#1) U2.N9(VDD#8) U2.R1(VDD#2) U2.R9(VDD#9)
SA0: U1.T17(SA0) U2.N3(A0)
SA1: U1.U18(SA1) U2.P7(A1)
SA2: U1.V19(SA2) U2.P3(A2)
SA3: U1.V20(SA3) U2.N2(A3)
SA4: U1.V21(SA4) U2.P8(A4)
SA5: U1.Y19(SA5) U2.P2(A5)
SA6: U1.Y20(SA6) U2.R8(A6)
SA7: U1.V15(SA7) U2.R2(A7)
SA8: U1.W18(SA8) U2.T8(A8)
SA9: U1.Y18(SA9) U2.R3(A9)
SA10: U1.P19(SA10) U2.L7(A10)
SA11: U1.N19(SA11) U2.R7(A11)
SA12: U1.R18(SA12) U2.N7(A12)
SA13: U1.V12(SA13) U2.T3(A13)
SA14: U1.N17(SA14) U2.T7(A14)
SA15: U1.R17(SA15) U2.M7(A15)
SBA0: U1.W17(SBA0) U2.M2(BA0)
SBA1: U1.T18(SBA1) U2.N8(BA1)
SBA2: U1.V17(SBA2) U2.M3(BA2)
SCAS: U1.U15(SCAS) U2.K3(CAS#)
SCKE0: U1.AA21(SCKE0) U2.K9(CKE)
SCKE1: U1.Y21(SCKE1) U2.J9(CKE1)
SCKN: R20.2 U1.AA20(SCKB) U2.K7(CK#)
SCKP: R20.1 U1.AA19(SCK) U2.J7(CK)
SCS0: U1.W20(SCS0) U2.L2(CS#)
SCS1: U1.W21(SCS1) U2.L1(CS1#)
SDQ0: U1.N20(SDQ0) U2.F7(DQ1)
SDQ1: U1.P21(SDQ1) U2.F2(DQ2)
SDQ2: U1.P20(SDQ2) U2.E3(DQ0)
SDQ3: U1.U21(SDQ3) U2.H3(DQ4)
SDQ4: U1.R19(SDQ4) U2.F8(DQ3)
SDQ5: U1.T20(SDQ5) U2.H7(DQ7)
SDQ6: U1.U19(SDQ6) U2.H8(DQ5)
SDQ7: U1.U20(SDQ7) U2.G2(DQ6)
SDQ8: U1.J19(SDQ8) U2.A3(DQ15)
SDQ9: U1.H20(SDQ9) U2.C3(DQ9)
SDQ10: U1.H21(SDQ10) U2.C2(DQ11)
SDQ11: U1.J21(SDQ11) U2.B8(DQ14)
SDQ12: U1.L20(SDQ12) U2.A7(DQ12)
SDQ13: U1.L21(SDQ13) U2.C8(DQ10)
SDQ14: U1.M21(SDQ14) U2.D7(DQ8)
SDQ15: U1.M19(SDQ15) U2.A2(DQ13)
SDQM0: U1.M20(SDQM0) U2.E7(DML)
SDQM1: U1.G20(SDQM1) U2.D3(DMU)
SDQS0N: U1.R21(SDQSB0) U2.G3(DQSL#)
SDQS0P: U1.R20(SDQS0) U2.F3(DQSL)
SDQS1N: U1.J20(SDQSB1) U2.B7(DQSU#)
SDQS1P: U1.K20(SDQS1) U2.C7(DQSU)
SODT0: U1.W11(SODT0) U2.K1(ODT)
SODT1: U1.V11(SODT1) U2.J1(ODT1)
SRAS: U1.V13(SRAS) U2.J3(RAS#)
SRST: U1.U16(SRST) U2.T2(RESET)
SVREF: C39.2 C40.2 C41.1 C54.2 R24.2 R25.1 U1.T16(SVREF) U2.H1(VREFDQ) U2.M8(VREFCA)
SWE: U1.W13(SWE) U2.L3(WE)
NetR21_2: R21.2 U2.L9(ZQ1)
NetR22_2: R22.2 U2.L8(ZQ)
NetR23_2: R23.2 U1.V10(SZQ)

Not connected (* = marked no-connect by the designer): U1 AA8(SDQ29)* AA9(SDQS3)* AA11(SDQ25)* AA12(SDQM3)* AA14(SDQ21)* AA15(SDQS2)* AA17(SDQ17)* AA18(SDQM2)* W9(SDQ28)* W12(SDQ24)* W15(SDQ19)* Y7(SDQ31)* Y8(SDQ30)* Y9(SDQSB3)* Y10(SDQ27)* Y11(SDQ26)* Y12(SDQ23)* Y13(SDQ22)* Y14(SDQ20)* Y15(SDQSB2)* Y16(SDQ18)* Y17(SDQ16)*

### Notes on the sheet
- H3_DDR3
- (in symbol H3-BGA3XX, part A) DRAM
- (in symbol H3-BGA3XX, part I) GND

### Library data of the parts
C39-C41 C43-C47 C49-C58 = C0402: 电容; Published: 8-Jun-2000; LatestRevisionDate: 17-Jul-2002; LatestRevisionNote: Re-released for DXP Platform.; PackageReference: RAD-0.3; Publisher: Altium Limited; PackageDescription: Radial Cap, Thru-Hole; 2 Leads; 0.3 in Pin Spacing; UnitPrice: 0.02
C42 C48 = C0603: 电容; Published: 8-Jun-2000; LatestRevisionDate: 17-Jul-2002; LatestRevisionNote: Re-released for DXP Platform.; PackageReference: RAD-0.3; Publisher: Altium Limited; PackageDescription: Radial Cap, Thru-Hole; 2 Leads; 0.3 in Pin Spacing; UnitPrice: 0.02
R20-R25 = RES0402: 电阻; Published: 8-Jun-2000; LatestRevisionDate: 17-Jul-2002; LatestRevisionNote: Re-released for DXP Platform.; PackageReference: AXIAL-0.3; Publisher: Altium Limited; PackageDescription: Axial Device, Thru-Hole; 2 Leads; 0.3 in Pin Spacing

## Sheet H3_USB.SchDoc
size A4
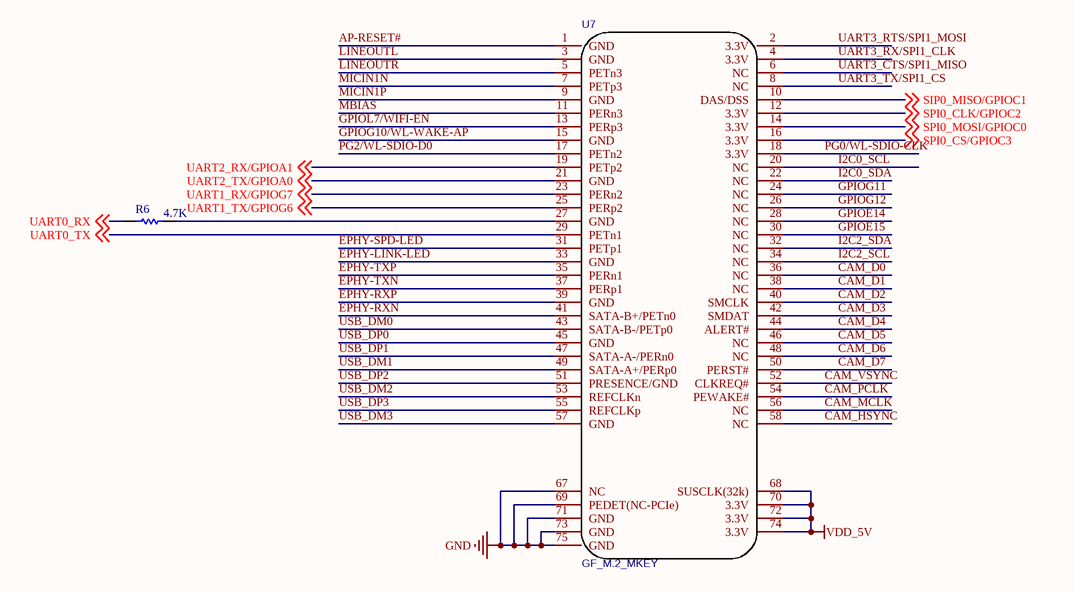
[diagram p4: H3_USB.SchDoc]

### Parts
R6  4.7K  [R0402]
U7  GF_M.2_MKEY  [GF_M.2_M_KEY]

### Nets
GND: U7.67(NC) U7.69(PEDET(NC-PCIe)) U7.71(GND) U7.73(GND) U7.75(GND)
VDD_5V: U7.68(SUSCLK(32k)) U7.70(3.3V) U7.72(3.3V) U7.74(3.3V)
AP-RESET#: U7.1(GND)
CAM_D0: U7.36(NC)
CAM_D1: U7.38(NC)
CAM_D2: U7.40(SMCLK)
CAM_D3: U7.42(SMDAT)
CAM_D4: U7.44(ALERT#)
CAM_D5: U7.46(NC)
CAM_D6: U7.48(NC)
CAM_D7: U7.50(PERST#)
CAM_HSYNC: U7.58(NC)
CAM_MCLK: U7.56(NC)
CAM_PCLK: U7.54(PEWAKE#)
CAM_VSYNC: U7.52(CLKREQ#)
EPHY-LINK-LED: U7.33(GND)
EPHY-RXN: U7.41(SATA-B+/PETn0)
EPHY-RXP: U7.39(GND)
EPHY-SPD-LED: U7.31(PETp1)
EPHY-TXN: U7.37(PERp1)
EPHY-TXP: U7.35(PERn1)
GPIOE14: U7.28(NC)
GPIOE15: U7.30(NC)
GPIOG10/WL-WAKE-AP: U7.15(GND)
GPIOG11: U7.24(NC)
GPIOG12: U7.26(NC)
GPIOL7/WIFI-EN: U7.13(PERp3)
I2C0_SCL: U7.20(NC)
I2C0_SDA: U7.22(NC)
I2C2_SCL: U7.34(NC)
I2C2_SDA: U7.32(NC)
LINEOUTL: U7.3(GND)
LINEOUTR: U7.5(PETn3)
MBIAS: U7.11(PERn3)
MICIN1N: U7.7(PETp3)
MICIN1P: U7.9(GND)
PG0/WL-SDIO-CLK: U7.18(3.3V)
PG2/WL-SDIO-D0: U7.17(PETn2)
SIP0_MISO/GPIOC1: U7.10(DAS/DSS) ; off-sheet SIP0_MISO/GPIOC1
SPI0_CLK/GPIOC2: U7.12(3.3V) ; off-sheet SPI0_CLK/GPIOC2
SPI0_CS/GPIOC3: U7.16(3.3V) ; off-sheet SPI0_CS/GPIOC3
SPI0_MOSI/GPIOC0: U7.14(3.3V) ; off-sheet SPI0_MOSI/GPIOC0
UART0_RX: R6.2 ; off-sheet UART0_RX
UART0_TX: U7.29(PETn1) ; off-sheet UART0_TX
UART1_RX/GPIOG7: U7.23(PERn2) ; off-sheet UART1_RX/GPIOG7
UART1_TX/GPIOG6: U7.25(PERp2) ; off-sheet UART1_TX/GPIOG6
UART2_RX/GPIOA1: U7.19(PETp2) ; off-sheet UART2_RX/GPIOA1
UART2_TX/GPIOA0: U7.21(GND) ; off-sheet UART2_TX/GPIOA0
UART3_CTS/SPI1_MISO: U7.6(NC)
UART3_RTS/SPI1_MOSI: U7.2(3.3V)
UART3_RX/SPI1_CLK: U7.4(3.3V)
UART3_TX/SPI1_CS: U7.8(NC)
USB_DM0: U7.43(SATA-B-/PETp0)
USB_DM1: U7.49(SATA-A+/PERp0)
USB_DM2: U7.53(REFCLKn)
USB_DM3: U7.57(GND)
USB_DP0: U7.45(GND)
USB_DP1: U7.47(SATA-A-/PERn0)
USB_DP2: U7.51(PRESENCE/GND)
USB_DP3: U7.55(REFCLKp)
NetR6_1: R6.1 U7.27(GND)

### Library data of the parts
R6 = RES0402: 电阻; Published: 8-Jun-2000; LatestRevisionDate: 17-Jul-2002; LatestRevisionNote: Re-released for DXP Platform.; PackageReference: AXIAL-0.3; Publisher: Altium Limited; PackageDescription: Axial Device, Thru-Hole; 2 Leads; 0.3 in Pin Spacing
U7 = GF_M.2_MKEY: BOM_Manufacturer: SHOWNAME=F; Contributor: redgragon; BOM_Manufacturer Part: SHOWNAME=F; BOM_Supplier Part: SHOWNAME=F; BOM_Supplier: SHOWNAME=F; link: SHOWNAME=F; spicePre: U; spiceSymbolName: GF_M.2_MKEY

## Sheet H3_eMMC.SchDoc
size A3
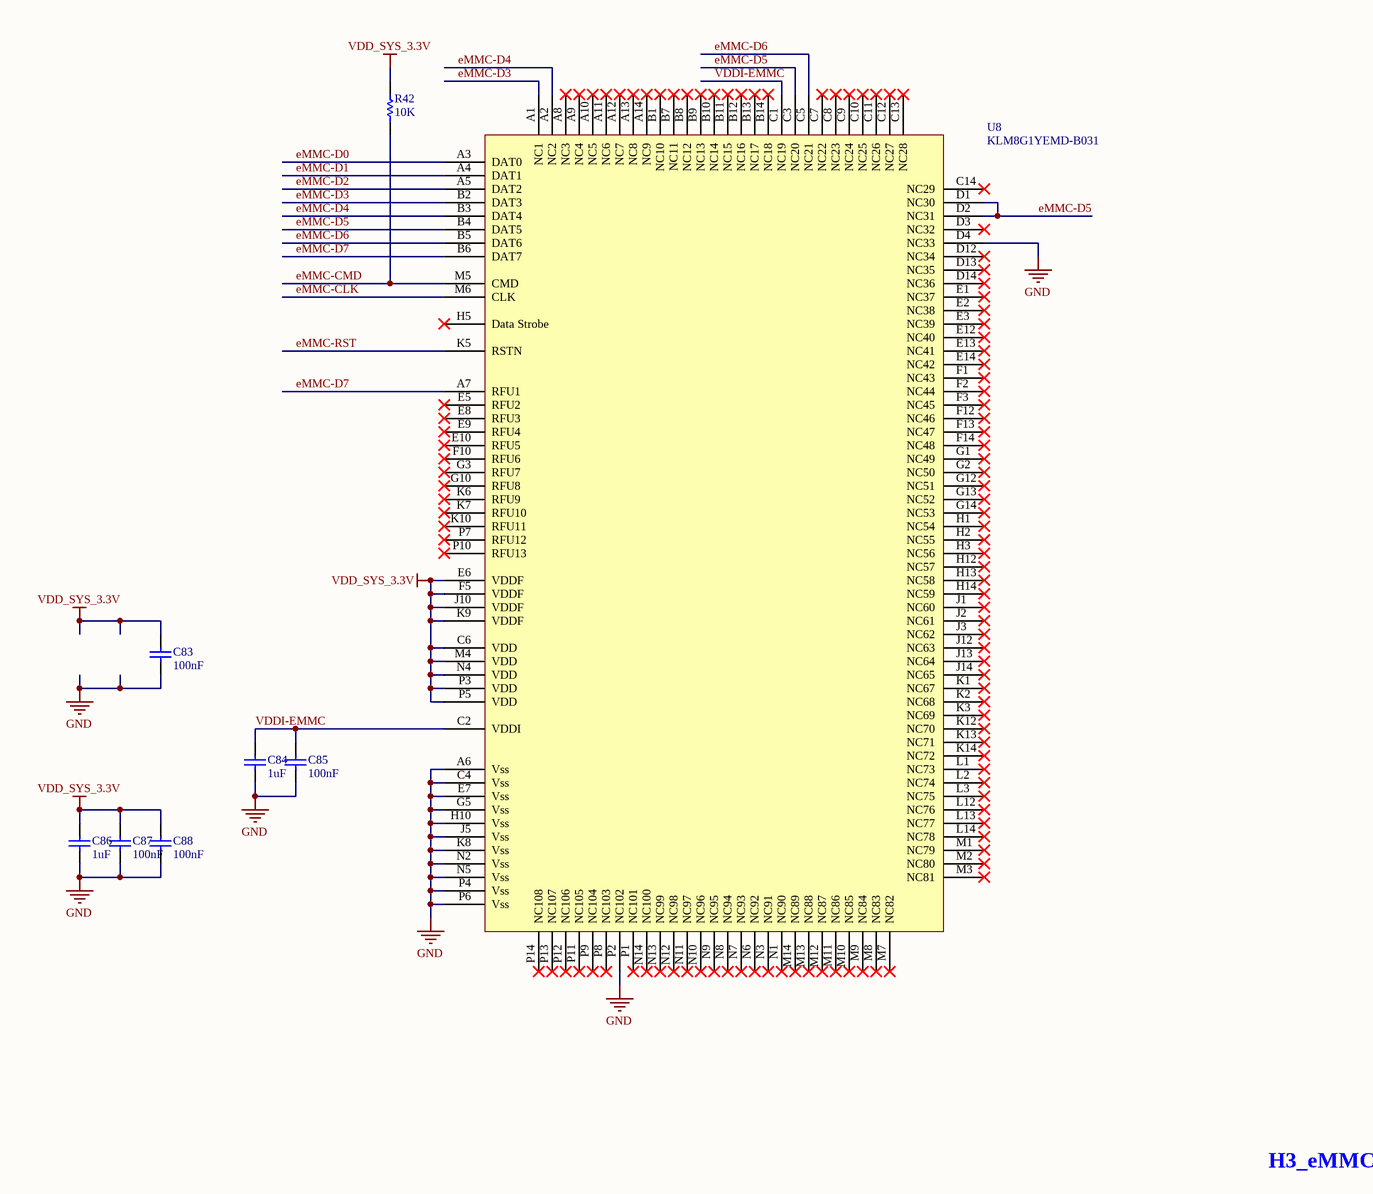
[diagram p5: H3_eMMC.SchDoc]

### Parts
C83  100nF  [C0402]
C84  1uF  [C0402]
C85  100nF  [C0402]
C86  1uF  [C0402]
C87  100nF  [C0402]
C88  100nF  [C0402]
R42  10K  [R0402]
U8  KLM8G1YEMD-B031  [FBGA153]

### Nets
GND: C83.1 C84.1 C85.1 C86.1 C87.1 C88.1 U8.A6(Vss) U8.C4(Vss) U8.D4(NC33) U8.E7(Vss) U8.G5(Vss) U8.H10(Vss) U8.J5(Vss) U8.K8(Vss) U8.N2(Vss) U8.N5(Vss) U8.P2(NC102) U8.P4(Vss) U8.P6(Vss)
VDD_SYS_3.3V: C83.2 C86.2 C87.2 C88.2 R42.2 U8.C6(VDD) U8.E6(VDDF) U8.F5(VDDF) U8.J10(VDDF) U8.K9(VDDF) U8.M4(VDD) U8.N4(VDD) U8.P3(VDD) U8.P5(VDD)
eMMC-CLK: U8.M6(CLK)
eMMC-CMD: R42.1 U8.M5(CMD)
eMMC-D0: U8.A3(DAT0)
eMMC-D1: U8.A4(DAT1)
eMMC-D2: U8.A5(DAT2)
eMMC-D3: U8.A1(NC1) U8.B2(DAT3)
eMMC-D4: U8.A2(NC2) U8.B3(DAT4)
eMMC-D5: U8.B4(DAT5) U8.C3(NC20) U8.D1(NC30) U8.D2(NC31)
eMMC-D6: U8.B5(DAT6) U8.C5(NC21)
eMMC-D7: U8.A7(RFU1) U8.B6(DAT7)
eMMC-RST: U8.K5(RSTN)
VDDI-EMMC: C84.2 C85.2 U8.C1(NC19) U8.C2(VDDI)

Not connected (* = marked no-connect by the designer): U8 A8(NC3)* A9(NC4)* A10(NC5)* A11(NC6)* A12(NC7)* A13(NC8)* A14(NC9)* B1(NC10)* B7(NC11)* B8(NC12)* B9(NC13)* B10(NC14)* B11(NC15)* B12(NC16)* B13(NC17)* B14(NC18)* C7(NC22)* C8(NC23)* C9(NC24)* C10(NC25)* C11(NC26)* C12(NC27)* C13(NC28)* C14(NC29)* D3(NC32)* D12(NC34)* D13(NC35)* D14(NC36)* E1(NC37)* E2(NC38)* E3(NC39)* E5(RFU2)* E8(RFU3)* E9(RFU4)* E10(RFU5)* E12(NC40)* E13(NC41)* E14(NC42)* F1(NC43)* F2(NC44)* F3(NC45)* F10(RFU6)* F12(NC46)* F13(NC47)* F14(NC48)* G1(NC49)* G2(NC50)* G3(RFU7)* G10(RFU8)* G12(NC51)* G13(NC52)* G14(NC53)* H1(NC54)* H2(NC55)* H3(NC56)* H5(Data_Strobe)* H12(NC57)* H13(NC58)* H14(NC59)* J1(NC60)* J2(NC61)* J3(NC62)* J12(NC63)* J13(NC64)* J14(NC65)* K1(NC67)* K2(NC68)* K3(NC69)* K6(RFU9)* K7(RFU10)* K10(RFU11)* K12(NC70)* K13(NC71)* K14(NC72)* L1(NC73)* L2(NC74)* L3(NC75)* L12(NC76)* L13(NC77)* L14(NC78)* M1(NC79)* M2(NC80)* M3(NC81)* M7(NC82)* M8(NC83)* M9(NC84)* M10(NC85)* M11(NC86)* M12(NC87)* M13(NC88)* M14(NC89)* N1(NC90)* N3(NC91)* N6(NC92)* N7(NC93)* N8(NC94)* N9(NC95)* N10(NC96)* N11(NC97)* N12(NC98)* N13(NC99)* N14(NC100)* P1(NC101)* P7(RFU12)* P8(NC103)* P9(NC104)* P10(RFU13)* P11(NC105)* P12(NC106)* P13(NC107)* P14(NC108)*

### Notes on the sheet
- H3_eMMC

### Library data of the parts
C83-C88 = C0402: 电容; Published: 8-Jun-2000; LatestRevisionDate: 17-Jul-2002; LatestRevisionNote: Re-released for DXP Platform.; PackageReference: RAD-0.3; Publisher: Altium Limited; PackageDescription: Radial Cap, Thru-Hole; 2 Leads; 0.3 in Pin Spacing; UnitPrice: 0.02
R42 = RES0402: 电阻; Published: 8-Jun-2000; LatestRevisionDate: 17-Jul-2002; LatestRevisionNote: Re-released for DXP Platform.; PackageReference: AXIAL-0.3; Publisher: Altium Limited; PackageDescription: Axial Device, Thru-Hole; 2 Leads; 0.3 in Pin Spacing

## Sheet H3_SDCard.SchDoc
size A4
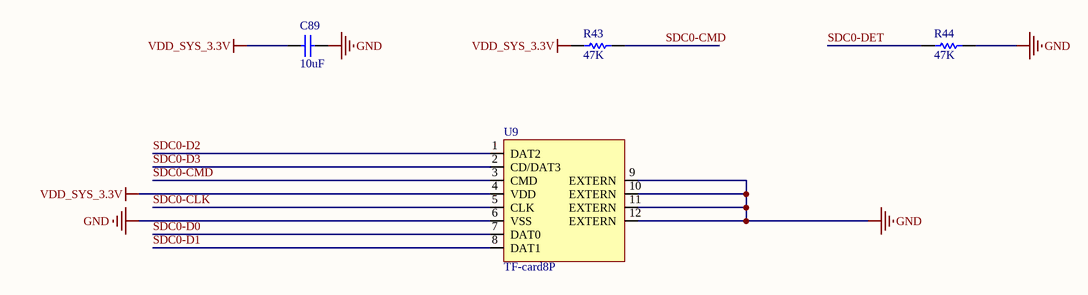
[diagram p6: H3_SDCard.SchDoc]

### Parts
C89  10uF  [C0402]
R43  47K  [R0402]
R44  47K  [R0402]
U9  TF-card8P  [TF-8P - duplicate]

### Nets
GND: C89.1 R44.1 U9.6(VSS) U9.9(EXTERN) U9.10(EXTERN) U9.11(EXTERN) U9.12(EXTERN)
VDD_SYS_3.3V: C89.2 R43.2 U9.4(VDD)
SDC0-CLK: U9.5(CLK)
SDC0-CMD: R43.1 U9.3(CMD)
SDC0-D0: U9.7(DAT0)
SDC0-D1: U9.8(DAT1)
SDC0-D2: U9.1(DAT2)
SDC0-D3: U9.2(CD/DAT3)
SDC0-DET: R44.2

### Library data of the parts
C89 = C0603: 电容; Published: 8-Jun-2000; LatestRevisionDate: 17-Jul-2002; LatestRevisionNote: Re-released for DXP Platform.; PackageReference: RAD-0.3; Publisher: Altium Limited; PackageDescription: Radial Cap, Thru-Hole; 2 Leads; 0.3 in Pin Spacing; UnitPrice: 0.02
R43 R44 = RES0402: 电阻; Published: 8-Jun-2000; LatestRevisionDate: 17-Jul-2002; LatestRevisionNote: Re-released for DXP Platform.; PackageReference: AXIAL-0.3; Publisher: Altium Limited; PackageDescription: Axial Device, Thru-Hole; 2 Leads; 0.3 in Pin Spacing

## Nets that join several sheets
GND: H3_Power (29 pins), H3_CPU_01 (14 pins), H3_CPU_02 (26 pins), H3_DDR3 (92 pins), H3_USB (5 pins), H3_eMMC (19 pins), H3_SDCard (7 pins)
VCC-DRAM: H3_Power (5 pins), H3_DDR3 (47 pins)
VDD1V1-EPHY: H3_Power (R34.1), H3_CPU_01 (C11.2 U1.F8)
VDD1V2-SYS: H3_Power (7 pins), H3_CPU_02 (18 pins)
VDD-CPUX: H3_Power (C60.2 C61.1 L1.1 U3.5), H3_CPU_02 (19 pins)
VDD_5V: H3_Power (13 pins), H3_USB (U7.68 U7.70 U7.72 U7.74)
VDD_AV_3.3V: H3_CPU_01 (6 pins), H3_CPU_02 (R15.1)
VDD_SYS_3.3V: H3_Power (9 pins), H3_CPU_01 (13 pins), H3_CPU_02 (17 pins), H3_eMMC (14 pins), H3_SDCard (C89.2 R43.2 U9.4)
AP-RESET#: H3_CPU_02 (C16.2 R12.1 U1.V6), H3_USB (U7.1)
CAM_D0: H3_CPU_01 (U1.C9), H3_USB (U7.36)
CAM_D1: H3_CPU_01 (U1.E10), H3_USB (U7.38)
CAM_D2: H3_CPU_01 (U1.D10), H3_USB (U7.40)
CAM_D3: H3_CPU_01 (U1.C8), H3_USB (U7.42)
CAM_D4: H3_CPU_01 (U1.C11), H3_USB (U7.44)
CAM_D5: H3_CPU_01 (U1.C12), H3_USB (U7.46)
CAM_D6: H3_CPU_01 (U1.E8), H3_USB (U7.48)
CAM_D7: H3_CPU_01 (U1.A11), H3_USB (U7.50)
CAM_HSYNC: H3_CPU_01 (U1.B11), H3_USB (U7.58)
CAM_MCLK: H3_CPU_01 (U1.A10), H3_USB (U7.56)
CAM_PCLK: H3_CPU_01 (U1.B10), H3_USB (U7.54)
CAM_VSYNC: H3_CPU_01 (U1.C10), H3_USB (U7.52)
eMMC-CLK: H3_CPU_01 (R3.1), H3_eMMC (U8.M6)
eMMC-CMD: H3_CPU_01 (U1.E16), H3_eMMC (R42.1 U8.M5)
eMMC-D0: H3_CPU_01 (U1.B18), H3_eMMC (U8.A3)
eMMC-D1: H3_CPU_01 (U1.C17), H3_eMMC (U8.A4)
eMMC-D2: H3_CPU_01 (U1.D17), H3_eMMC (U8.A5)
eMMC-D3: H3_CPU_01 (U1.C18), H3_eMMC (U8.A1 U8.B2)
eMMC-D4: H3_CPU_01 (U1.B17), H3_eMMC (U8.A2 U8.B3)
eMMC-D5: H3_CPU_01 (U1.B19), H3_eMMC (U8.B4 U8.C3 U8.D1 U8.D2)
eMMC-D6: H3_CPU_01 (U1.F17), H3_eMMC (U8.B5 U8.C5)
eMMC-D7: H3_CPU_01 (U1.C19), H3_eMMC (U8.A7 U8.B6)
eMMC-RST: H3_CPU_01 (U1.H16), H3_eMMC (U8.K5)
EPHY-LINK-LED: H3_CPU_01 (C12.2 U1.A2), H3_USB (U7.33)
EPHY-RXN: H3_CPU_01 (U1.A4), H3_USB (U7.41)
EPHY-RXP: H3_CPU_01 (U1.B4), H3_USB (U7.39)
EPHY-SPD-LED: H3_CPU_01 (C9.2 U1.F7), H3_USB (U7.31)
EPHY-TXN: H3_CPU_01 (U1.A3), H3_USB (U7.37)
EPHY-TXP: H3_CPU_01 (U1.B3), H3_USB (U7.35)
GPIOA10/STATUS-LED: H3_Power (R41.2), H3_CPU_01 (U1.E11)
GPIOE14: H3_CPU_01 (U1.C6), H3_USB (U7.28)
GPIOE15: H3_CPU_01 (U1.C5), H3_USB (U7.30)
GPIOG10/WL-WAKE-AP: H3_CPU_01 (U1.M3), H3_USB (U7.15)
GPIOG11: H3_CPU_01 (U1.D2), H3_USB (U7.24)
GPIOG12: H3_CPU_01 (U1.D1), H3_USB (U7.26)
GPIOL6/CPUX-VSET: H3_Power (Q1.1 R31.1), H3_CPU_01 (U1.T4)
GPIOL7/WIFI-EN: H3_CPU_01 (U1.T3), H3_USB (U7.13)
GPIOL8/PWR-STB: H3_Power (R33.1 U3.8 U6.1), H3_CPU_01 (U1.T2)
GPIOL9/PWR-DRAM: H3_Power (R32.1 U5.1), H3_CPU_01 (U1.M6)
GPIOL10/PWR-LED: H3_Power (R39.1 R40.2), H3_CPU_01 (U1.V2)
I2C0_SCL: H3_CPU_01 (U1.F11), H3_USB (U7.20)
I2C0_SDA: H3_CPU_01 (U1.C13), H3_USB (U7.22)
I2C2_SCL: H3_CPU_01 (U1.A12), H3_USB (U7.34)
I2C2_SDA: H3_CPU_01 (U1.C7), H3_USB (U7.32)
LINEOUTL: H3_CPU_01 (U1.AA3), H3_USB (U7.3)
LINEOUTR: H3_CPU_01 (U1.Y3), H3_USB (U7.5)
MBIAS: H3_CPU_01 (C20.1 U1.W3), H3_USB (U7.11)
MICIN1N: H3_CPU_01 (U1.Y1), H3_USB (U7.7)
MICIN1P: H3_CPU_01 (U1.W2), H3_USB (U7.9)
PG0/WL-SDIO-CLK: H3_CPU_01 (U1.J3), H3_USB (U7.18)
PG2/WL-SDIO-D0: H3_CPU_01 (U1.H4), H3_USB (U7.17)
SDC0-CLK: H3_CPU_01 (U1.D20), H3_SDCard (U9.5)
SDC0-CMD: H3_CPU_01 (U1.F18), H3_SDCard (R43.1 U9.3)
SDC0-D0: H3_CPU_01 (U1.A19), H3_SDCard (U9.7)
SDC0-D1: H3_CPU_01 (U1.D19), H3_SDCard (U9.8)
SDC0-D2: H3_CPU_01 (U1.C20), H3_SDCard (U9.1)
SDC0-D3: H3_CPU_01 (U1.E21), H3_SDCard (U9.2)
SDC0-DET: H3_CPU_01 (U1.G18), H3_SDCard (R44.2)
SIP0_MISO/GPIOC1: H3_CPU_01 (U1.C16), H3_USB (U7.10)
SPI0_CLK/GPIOC2: H3_CPU_01 (U1.B16), H3_USB (U7.12)
SPI0_CS/GPIOC3: H3_CPU_01 (U1.B15), H3_USB (U7.16)
SPI0_MOSI/GPIOC0: H3_CPU_01 (U1.C15), H3_USB (U7.14)
UART0_RX: H3_CPU_01 (U1.H6), H3_USB (R6.2)
UART0_TX: H3_CPU_01 (U1.F5), H3_USB (U7.29)
UART1_RX/GPIOG7: H3_CPU_01 (U1.D3), H3_USB (U7.23)
UART1_TX/GPIOG6: H3_CPU_01 (U1.G4), H3_USB (U7.25)
UART2_RX/GPIOA1: H3_CPU_01 (U1.D5), H3_USB (U7.19)
UART2_TX/GPIOA0: H3_CPU_01 (U1.D11), H3_USB (U7.21)
UART3_CTS/SPI1_MISO: H3_CPU_01 (U1.D15), H3_USB (U7.6)
UART3_RTS/SPI1_MOSI: H3_CPU_01 (U1.F14), H3_USB (U7.2)
UART3_RX/SPI1_CLK: H3_CPU_01 (U1.G12), H3_USB (U7.4)
UART3_TX/SPI1_CS: H3_CPU_01 (U1.E15), H3_USB (U7.8)
USB_DM0: H3_CPU_02 (U1.B5), H3_USB (U7.43)
USB_DM1: H3_CPU_02 (U1.B7), H3_USB (U7.49)
USB_DM2: H3_CPU_02 (U1.A8), H3_USB (U7.53)
USB_DM3: H3_CPU_02 (U1.B9), H3_USB (U7.57)
USB_DP0: H3_CPU_02 (U1.A5), H3_USB (U7.45)
USB_DP1: H3_CPU_02 (U1.B6), H3_USB (U7.47)
USB_DP2: H3_CPU_02 (U1.A7), H3_USB (U7.51)
USB_DP3: H3_CPU_02 (U1.B8), H3_USB (U7.55)
VDD-CPUFB: H3_Power (C69.2 R27.1), H3_CPU_02 (R16.1 U1.T10)